# Altium project AMC_FMC_Carrier.PrjPcb (part 2 of 9)

## Sheet FPGA_SDRAM.SchDoc
size A3; DocumentNumber: 18; SheetNumber: 18; SheetTotal: 30
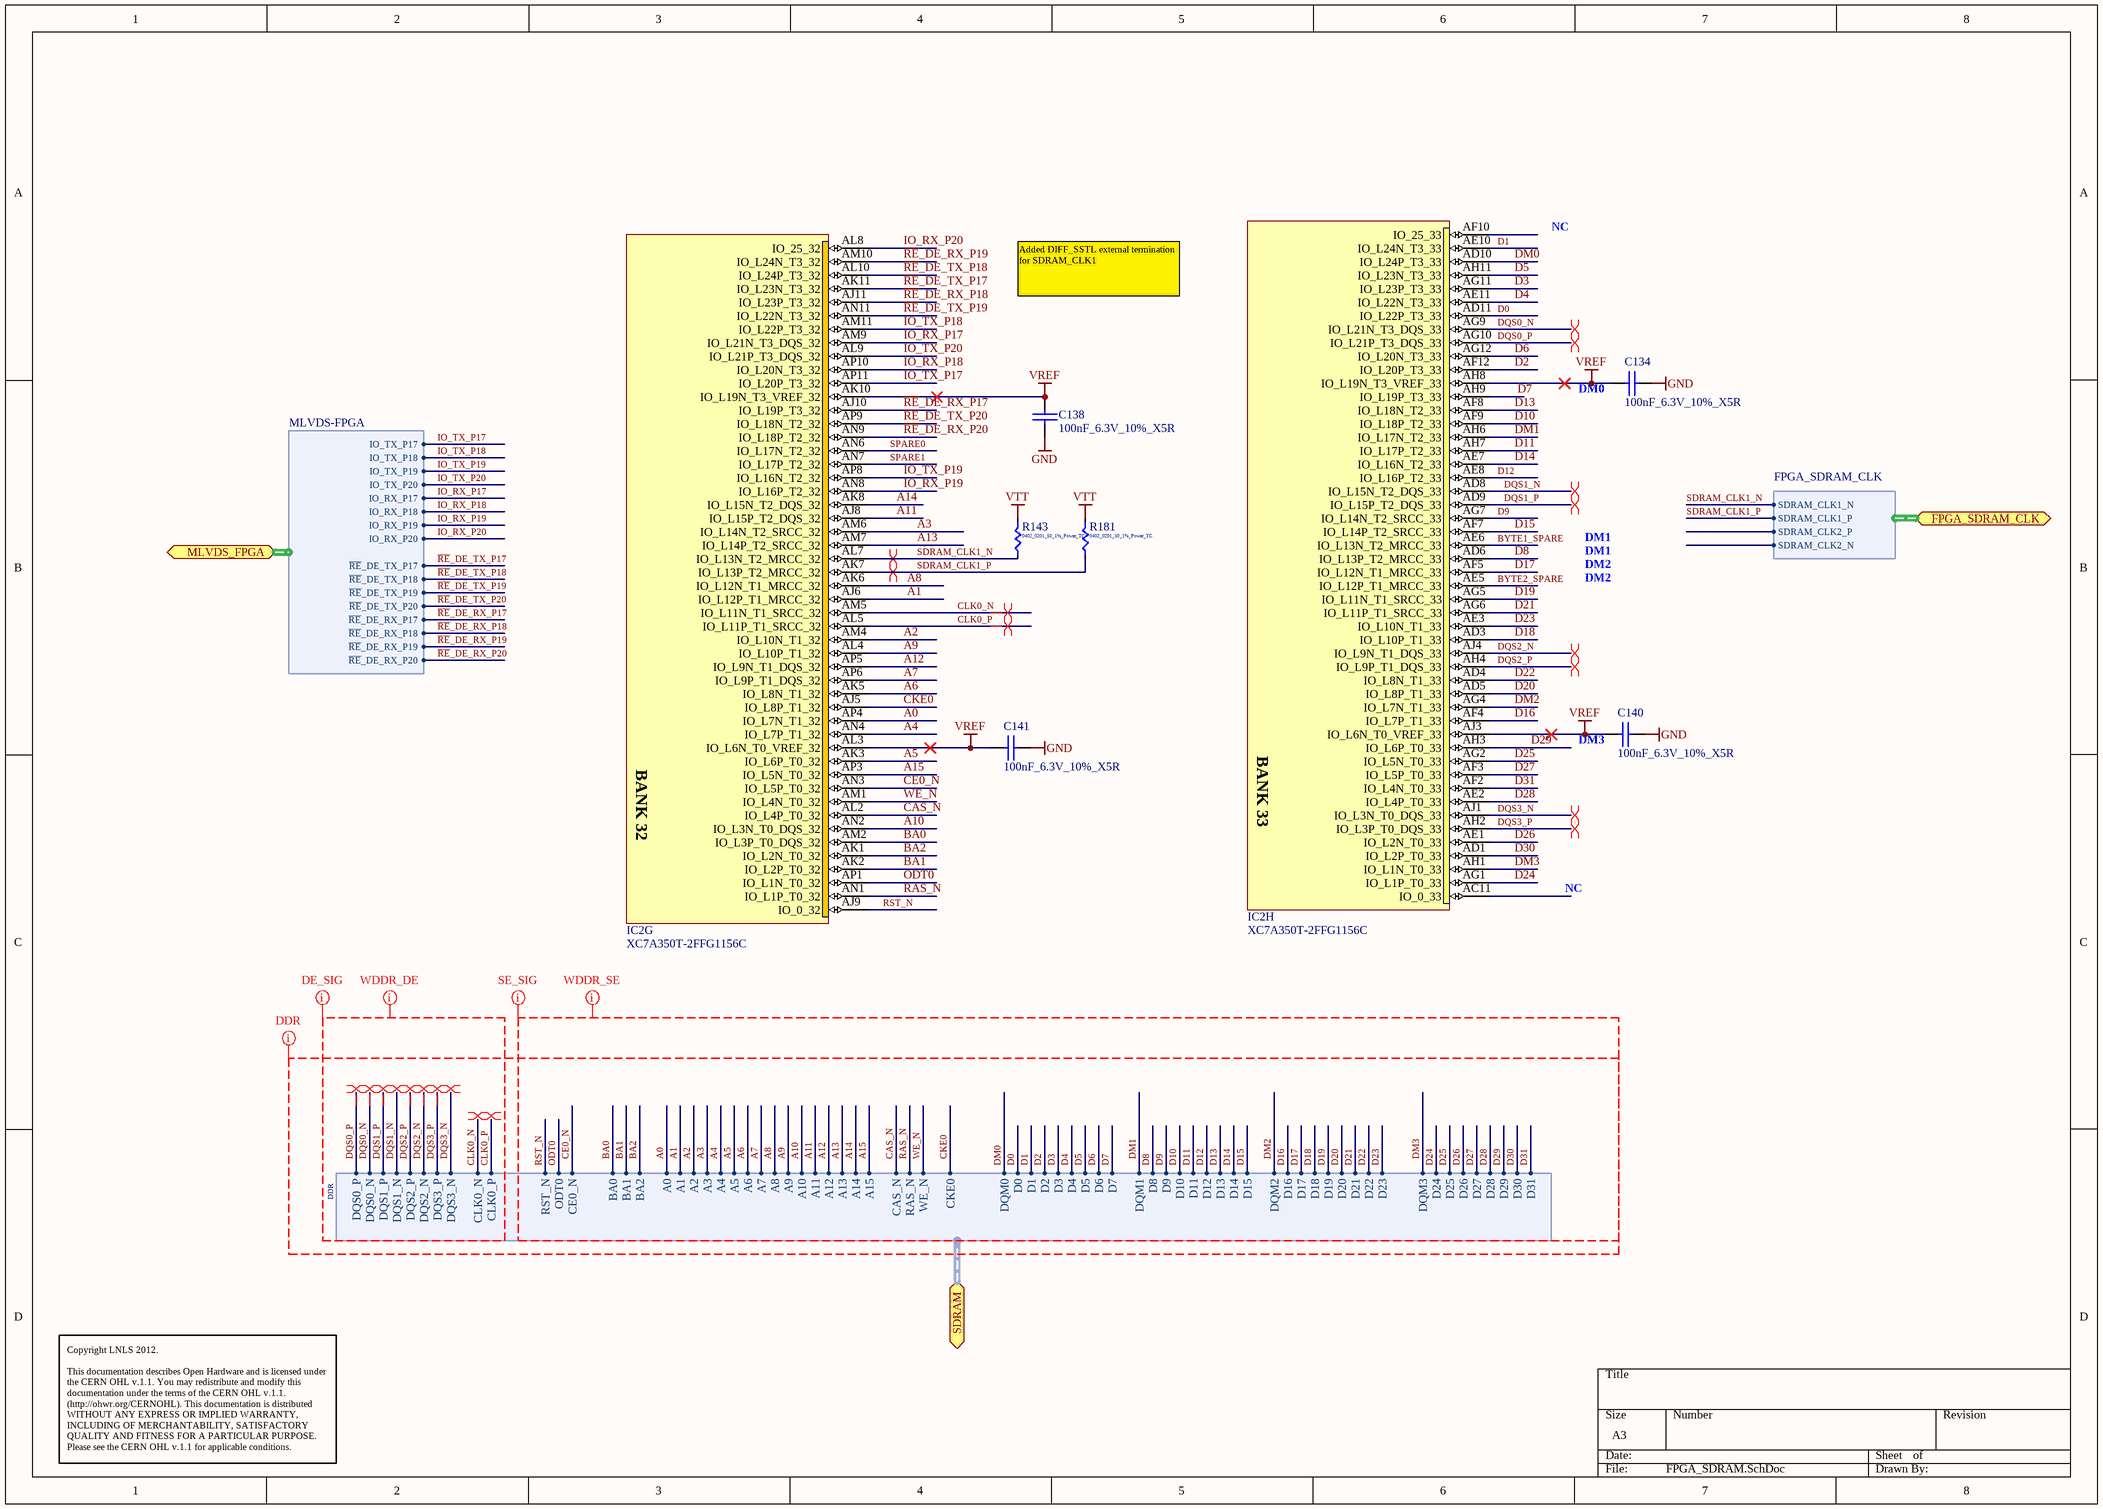
[diagram p4: FPGA_SDRAM.SchDoc]

### Parts
C134  100nF_6.3V_10%_X5R  [0201C]
C138  100nF_6.3V_10%_X5R  [0201C]
C140  100nF_6.3V_10%_X5R  [0201C]
C141  100nF_6.3V_10%_X5R  [0201C]
IC2  XC7A350T-2FFG1156C  [BGA1156C100P34X34_3500X3500X335]  (parts G,H of 23)
R143  0402_0201_50_1%_Power_TC  [RESC0603X40N]
R181  0402_0201_50_1%_Power_TC  [RESC0603X40N]

### Ports
FPGA_SDRAM_CLK (harness FPGA_SDRAM_CLK), MLVDS_FPGA (harness MLVDS-FPGA), SDRAM (harness DDR)

### Harnesses
DDR: CKE0, A0, A1, A2, A3, A4, A5, A7, A8, A9, A10, A11, A12, A13, BA0, BA1, BA2, A14, A15, CAS_N, RAS_N, WE_N, CE0_N, A6, D0, D1, D2, D3, D4, D5, D6, D7, D8, D9, D10, D11, D12, D13, D14, D15, CLK0_N, CLK0_P, ODT0, RST_N, D16, D17, D18, D19, D20, D21, D22, D23, D24, D25, D26, D27, D28, D29, D30, D31, DQS0_P, DQS1_P, DQS0_N, DQS1_N, DQS3_N, DQS3_P, DQS2_P, DQS2_N, DQM0, DQM1, DQM2, DQM3
MLVDS-FPGA: IO_TX_P17, IO_TX_P18, IO_TX_P19, IO_TX_P20, IO_RX_P17, IO_RX_P18, IO_RX_P19, IO_RX_P20, ~{RE}_DE_TX_P17, ~{RE}_DE_TX_P18, ~{RE}_DE_TX_P19, ~{RE}_DE_TX_P20, ~{RE}_DE_RX_P17, ~{RE}_DE_RX_P18, ~{RE}_DE_RX_P19, ~{RE}_DE_RX_P20
FPGA_SDRAM_CLK: SDRAM_CLK1_N, SDRAM_CLK1_P, SDRAM_CLK2_P, SDRAM_CLK2_N

### Nets
GND: C134.2 C138.2 C140.2 C141.2
VREF: C134.1 C138.1 C140.1 C141.1 IC2.AH8(IO_L19N_T3_VREF_33) IC2.AJ3(IO_L6N_T0_VREF_33) IC2.AK10(IO_L19N_T3_VREF_32) IC2.AL3(IO_L6N_T0_VREF_32)
VTT: R143.1(+) R181.1(+)
A0: IC2.AP4(IO_L7N_T1_32) ; port SDRAM.A0  [project net FDDR.A0]
A1: IC2.AJ6(IO_L12P_T1_MRCC_32) ; port SDRAM.A1  [project net FDDR.A1]
A2: IC2.AM4(IO_L10N_T1_32) ; port SDRAM.A2  [project net FDDR.A2]
A3: IC2.AM6(IO_L14N_T2_SRCC_32) ; port SDRAM.A3  [project net FDDR.A3]
A4: IC2.AN4(IO_L7P_T1_32) ; port SDRAM.A4  [project net FDDR.A4]
A5: IC2.AK3(IO_L6P_T0_32) ; port SDRAM.A5  [project net FDDR.A5]
A6: IC2.AK5(IO_L8N_T1_32) ; port SDRAM.A6  [project net FDDR.A6]
A7: IC2.AP6(IO_L9P_T1_DQS_32) ; port SDRAM.A7  [project net FDDR.A7]
A8: IC2.AK6(IO_L12N_T1_MRCC_32) ; port SDRAM.A8  [project net FDDR.A8]
A9: IC2.AL4(IO_L10P_T1_32) ; port SDRAM.A9  [project net FDDR.A9]
A10: IC2.AN2(IO_L3N_T0_DQS_32) ; port SDRAM.A10  [project net FDDR.A10]
A11: IC2.AJ8(IO_L15P_T2_DQS_32) ; port SDRAM.A11  [project net FDDR.A11]
A12: IC2.AP5(IO_L9N_T1_DQS_32) ; port SDRAM.A12  [project net FDDR.A12]
A13: IC2.AM7(IO_L14P_T2_SRCC_32) ; port SDRAM.A13  [project net FDDR.A13]
A14: IC2.AK8(IO_L15N_T2_DQS_32) ; port SDRAM.A14  [project net FDDR.A14]
A15: IC2.AP3(IO_L5N_T0_32) ; port SDRAM.A15  [project net FDDR.A15]
BA0: IC2.AM2(IO_L3P_T0_DQS_32) ; port SDRAM.BA0  [project net FDDR.BA0]
BA1: IC2.AK2(IO_L2P_T0_32) ; port SDRAM.BA1  [project net FDDR.BA1]
BA2: IC2.AK1(IO_L2N_T0_32) ; port SDRAM.BA2  [project net FDDR.BA2]
BYTE1_SPARE: IC2.AE6(IO_L13N_T2_MRCC_33)
BYTE2_SPARE: IC2.AE5(IO_L12P_T1_MRCC_33)
CAS_N: IC2.AL2(IO_L4P_T0_32) ; port SDRAM.CAS_N  [project net FDDR.CAS_N]
CE0_N: IC2.AN3(IO_L5P_T0_32) ; port SDRAM.CE0_N  [project net FDDR.CE0_N]
CKE0: IC2.AJ5(IO_L8P_T1_32) ; port SDRAM.CKE0  [project net FDDR.CKE0]
CLK0_N: IC2.AM5(IO_L11N_T1_SRCC_32) ; port SDRAM.CLK0_N  [project net FDDR.CLK0_N]
CLK0_P: IC2.AL5(IO_L11P_T1_SRCC_32) ; port SDRAM.CLK0_P  [project net FDDR.CLK0_P]
D0: IC2.AD11(IO_L22P_T3_33) ; port SDRAM.D0  [project net FDDR.D0]
D1: IC2.AE10(IO_L24N_T3_33) ; port SDRAM.D1  [project net FDDR.D1]
D2: IC2.AF12(IO_L20P_T3_33) ; port SDRAM.D2  [project net FDDR.D2]
D3: IC2.AG11(IO_L23P_T3_33) ; port SDRAM.D3  [project net FDDR.D3]
D4: IC2.AE11(IO_L22N_T3_33) ; port SDRAM.D4  [project net FDDR.D4]
D5: IC2.AH11(IO_L23N_T3_33) ; port SDRAM.D5  [project net FDDR.D5]
D6: IC2.AG12(IO_L20N_T3_33) ; port SDRAM.D6  [project net FDDR.D6]
D7: IC2.AH9(IO_L19P_T3_33) ; port SDRAM.D7  [project net FDDR.D7]
D8: IC2.AD6(IO_L13P_T2_MRCC_33) ; port SDRAM.D8  [project net FDDR.D8]
D9: IC2.AG7(IO_L14N_T2_SRCC_33) ; port SDRAM.D9  [project net FDDR.D9]
D10: IC2.AF9(IO_L18P_T2_33) ; port SDRAM.D10  [project net FDDR.D10]
D11: IC2.AH7(IO_L17P_T2_33) ; port SDRAM.D11  [project net FDDR.D11]
D12: IC2.AE8(IO_L16P_T2_33) ; port SDRAM.D12  [project net FDDR.D12]
D13: IC2.AF8(IO_L18N_T2_33) ; port SDRAM.D13  [project net FDDR.D13]
D14: IC2.AE7(IO_L16N_T2_33) ; port SDRAM.D14  [project net FDDR.D14]
D15: IC2.AF7(IO_L14P_T2_SRCC_33) ; port SDRAM.D15  [project net FDDR.D15]
D16: IC2.AF4(IO_L7P_T1_33) ; port SDRAM.D16  [project net FDDR.D16]
D17: IC2.AF5(IO_L12N_T1_MRCC_33) ; port SDRAM.D17  [project net FDDR.D17]
D18: IC2.AD3(IO_L10P_T1_33) ; port SDRAM.D18  [project net FDDR.D18]
D19: IC2.AG5(IO_L11N_T1_SRCC_33) ; port SDRAM.D19  [project net FDDR.D19]
D20: IC2.AD5(IO_L8P_T1_33) ; port SDRAM.D20  [project net FDDR.D20]
D21: IC2.AG6(IO_L11P_T1_SRCC_33) ; port SDRAM.D21  [project net FDDR.D21]
D22: IC2.AD4(IO_L8N_T1_33) ; port SDRAM.D22  [project net FDDR.D22]
D23: IC2.AE3(IO_L10N_T1_33) ; port SDRAM.D23  [project net FDDR.D23]
D24: IC2.AG1(IO_L1P_T0_33) ; port SDRAM.D24  [project net FDDR.D24]
D25: IC2.AG2(IO_L5N_T0_33) ; port SDRAM.D25  [project net FDDR.D25]
D26: IC2.AE1(IO_L2N_T0_33) ; port SDRAM.D26  [project net FDDR.D26]
D27: IC2.AF3(IO_L5P_T0_33) ; port SDRAM.D27  [project net FDDR.D27]
D28: IC2.AE2(IO_L4P_T0_33) ; port SDRAM.D28  [project net FDDR.D28]
D29: IC2.AH3(IO_L6P_T0_33) ; port SDRAM.D29  [project net FDDR.D29]
D30: IC2.AD1(IO_L2P_T0_33) ; port SDRAM.D30  [project net FDDR.D30]
D31: IC2.AF2(IO_L4N_T0_33) ; port SDRAM.D31  [project net FDDR.D31]
DM0: IC2.AD10(IO_L24P_T3_33) ; port SDRAM.DQM0  [project net FDDR.DQM0]
DM1: IC2.AH6(IO_L17N_T2_33) ; port SDRAM.DQM1  [project net FDDR.DQM1]
DM2: IC2.AG4(IO_L7N_T1_33) ; port SDRAM.DQM2  [project net FDDR.DQM2]
DM3: IC2.AH1(IO_L1N_T0_33) ; port SDRAM.DQM3  [project net FDDR.DQM3]
DQS0_N: IC2.AG9(IO_L21N_T3_DQS_33) ; port SDRAM.DQS0_N  [project net FDDR.DQS0_N]
DQS0_P: IC2.AG10(IO_L21P_T3_DQS_33) ; port SDRAM.DQS0_P  [project net FDDR.DQS0_P]
DQS1_N: IC2.AD8(IO_L15N_T2_DQS_33) ; port SDRAM.DQS1_N  [project net FDDR.DQS1_N]
DQS1_P: IC2.AD9(IO_L15P_T2_DQS_33) ; port SDRAM.DQS1_P  [project net FDDR.DQS1_P]
DQS2_N: IC2.AJ4(IO_L9N_T1_DQS_33) ; port SDRAM.DQS2_N  [project net FDDR.DQS2_N]
DQS2_P: IC2.AH4(IO_L9P_T1_DQS_33) ; port SDRAM.DQS2_P  [project net FDDR.DQS2_P]
DQS3_N: IC2.AJ1(IO_L3N_T0_DQS_33) ; port SDRAM.DQS3_N  [project net FDDR.DQS3_N]
DQS3_P: IC2.AH2(IO_L3P_T0_DQS_33) ; port SDRAM.DQS3_P  [project net FDDR.DQS3_P]
IO_RX_P17: IC2.AM9(IO_L21N_T3_DQS_32) ; port MLVDS_FPGA.IO_RX_P17  [project net MLVDS_F.IO_RX_P17]
IO_RX_P18: IC2.AP10(IO_L20N_T3_32) ; port MLVDS_FPGA.IO_RX_P18  [project net MLVDS_F.IO_RX_P18]
IO_RX_P19: IC2.AN8(IO_L16P_T2_32) ; port MLVDS_FPGA.IO_RX_P19  [project net MLVDS_F.IO_RX_P19]
IO_RX_P20: IC2.AL8(IO_25_32) ; port MLVDS_FPGA.IO_RX_P20  [project net MLVDS_F.IO_RX_P20]
IO_TX_P17: IC2.AP11(IO_L20P_T3_32) ; port MLVDS_FPGA.IO_TX_P17  [project net MLVDS_F.IO_TX_P17]
IO_TX_P18: IC2.AM11(IO_L22P_T3_32) ; port MLVDS_FPGA.IO_TX_P18  [project net MLVDS_F.IO_TX_P18]
IO_TX_P19: IC2.AP8(IO_L16N_T2_32) ; port MLVDS_FPGA.IO_TX_P19  [project net MLVDS_F.IO_TX_P19]
IO_TX_P20: IC2.AL9(IO_L21P_T3_DQS_32) ; port MLVDS_FPGA.IO_TX_P20  [project net MLVDS_F.IO_TX_P20]
ODT0: IC2.AP1(IO_L1N_T0_32) ; port SDRAM.ODT0  [project net FDDR.ODT0]
~{RE}_DE_RX_P17: IC2.AJ10(IO_L19P_T3_32) ; port MLVDS_FPGA.~{RE}_DE_RX_P17  [project net MLVDS_F.~{RE}_DE_RX_P17]
~{RE}_DE_RX_P18: IC2.AJ11(IO_L23P_T3_32) ; port MLVDS_FPGA.~{RE}_DE_RX_P18  [project net MLVDS_F.~{RE}_DE_RX_P18]
~{RE}_DE_RX_P19: IC2.AM10(IO_L24N_T3_32) ; port MLVDS_FPGA.~{RE}_DE_RX_P19  [project net MLVDS_F.~{RE}_DE_RX_P19]
~{RE}_DE_RX_P20: IC2.AN9(IO_L18P_T2_32) ; port MLVDS_FPGA.~{RE}_DE_RX_P20  [project net MLVDS_F.~{RE}_DE_RX_P20]
~{RE}_DE_TX_P17: IC2.AK11(IO_L23N_T3_32) ; port MLVDS_FPGA.~{RE}_DE_TX_P17  [project net MLVDS_F.~{RE}_DE_TX_P17]
~{RE}_DE_TX_P18: IC2.AL10(IO_L24P_T3_32) ; port MLVDS_FPGA.~{RE}_DE_TX_P18  [project net MLVDS_F.~{RE}_DE_TX_P18]
~{RE}_DE_TX_P19: IC2.AN11(IO_L22N_T3_32) ; port MLVDS_FPGA.~{RE}_DE_TX_P19  [project net MLVDS_F.~{RE}_DE_TX_P19]
~{RE}_DE_TX_P20: IC2.AP9(IO_L18N_T2_32) ; port MLVDS_FPGA.~{RE}_DE_TX_P20  [project net MLVDS_F.~{RE}_DE_TX_P20]
RAS_N: IC2.AN1(IO_L1P_T0_32) ; port SDRAM.RAS_N  [project net FDDR.RAS_N]
RST_N: IC2.AJ9(IO_0_32) ; port SDRAM.RST_N  [project net FDDR.RST_N]
SDRAM_CLK1_N: IC2.AL7(IO_L13N_T2_MRCC_32) R143.2(-) ; port FPGA_SDRAM_CLK.SDRAM_CLK1_N  [project net FSDC.SDRAM_CLK1_N]
SDRAM_CLK1_P: IC2.AK7(IO_L13P_T2_MRCC_32) R181.2(-) ; port FPGA_SDRAM_CLK.SDRAM_CLK1_P  [project net FSDC.SDRAM_CLK1_P]
SPARE0: IC2.AN6(IO_L17N_T2_32)
SPARE1: IC2.AN7(IO_L17P_T2_32)
WE_N: IC2.AM1(IO_L4N_T0_32) ; port SDRAM.WE_N  [project net FDDR.WE_N]

Not connected (* = marked no-connect by the designer): IC2 AC11(IO_0_33) AF10(IO_25_33)

### Layout directives
differential pair: FDDR.CLK0_N, FDDR.CLK0_P, FDDR.DQS0_N, FDDR.DQS0_P, FDDR.DQS1_N, FDDR.DQS1_P, FDDR.DQS2_N, FDDR.DQS2_P, FDDR.DQS3_N, FDDR.DQS3_P, FSDC.SDRAM_CLK1_N, FSDC.SDRAM_CLK1_P
net class DDR: A0, A1, A2, A3, A4, A5, A6, A7, A8, A9, A10, A11, A12, A13, A14, A15, BA0, BA1, BA2, CAS_N, CE0_N, CKE0, CLK0_N, CLK0_P, D0, D1, D2, D3, D4, D5, D6, D7, D8, D9, D10, D11, D12, D13, D14, D15, D16, D17, D18, D19, D20, D21, D22, D23, D24, D25, D26, D27, D28, D29, D30, D31, DM0, DM1, DM2, DM3, DQS0_N, DQS0_P, DQS1_N, DQS1_P, DQS2_N, DQS2_P, DQS3_N, DQS3_P, ODT0, RAS_N, RST_N, WE_N
net class DE_SIG: CLK0_N, CLK0_P, DQS0_N, DQS0_P, DQS1_N, DQS1_P, DQS2_N, DQS2_P, DQS3_N, DQS3_P
net class SE_SIG: A0, A1, A2, A3, A4, A5, A6, A7, A8, A9, A10, A11, A12, A13, A14, A15, BA0, BA1, BA2, CAS_N, CE0_N, CKE0, D0, D1, D2, D3, D4, D5, D6, D7, D8, D9, D10, D11, D12, D13, D14, D15, D16, D17, D18, D19, D20, D21, D22, D23, D24, D25, D26, D27, D28, D29, D30, D31, DM0, DM1, DM2, DM3, ODT0, RAS_N, RST_N, WE_N
net class WDDR_DE: CLK0_N, CLK0_P, DQS0_N, DQS0_P, DQS1_N, DQS1_P, DQS2_N, DQS2_P, DQS3_N, DQS3_P
net class WDDR_SE: A0, A1, A2, A3, A4, A5, A6, A7, A8, A9, A10, A11, A12, A13, A14, A15, BA0, BA1, BA2, CAS_N, CE0_N, CKE0, D0, D1, D2, D3, D4, D5, D6, D7, D8, D9, D10, D11, D12, D13, D14, D15, D16, D17, D18, D19, D20, D21, D22, D23, D24, D25, D26, D27, D28, D29, D30, D31, DM0, DM1, DM2, DM3, ODT0, RAS_N, RST_N, WE_N

### Notes on the sheet
- NC
- Added DIFF_SSTL external termination for SDRAM_CLK1
- (near C134) DM0
- DM1
- DM2
- (near C140) DM3
- Copyright LNLS 2012.
  This documentation describes Open Hardware and is licensed under the CERN OHL v.1.1. You may redistribute and modify this documentation under the terms of the CERN OHL v.1.1. (http://ohwr.org/CERNOHL). This documentation is distributed WITHOUT ANY EXPRESS OR IMPLIED WARRANTY, INCLUDING OF MERCHANTABILITY, SATISFACTORY QUALITY AND FITNESS FOR A PARTICULAR PURPOSE. Please see the CERN OHL v.1.1 for applicable conditions.
- (in symbol XC7A350T-2FFG1156C, part G) BANK 32
- (in symbol XC7A350T-2FFG1156C, part H) BANK 33

### Library data of the parts
C134 C138 C140 C141 = CAP_SMD_0201: Capacitor SMD
IC2 = XC7A350T-2FFG1156C: as IC2 on sheet FPGA; Part Number: XC7A350T-2FFG1156C; Component Kind: Standard; Component Type: Standard; Device: XC7A350T-2FFG1156C; PackageDescription: BGA, 1.00mm Pitch, Square; 1156 Pin, 34 Columns X 34 Rows, 35.00mm X 35.00mm X 3.350mm H; Manufacturer Part Number: XC7A350T-2FFG1156C; Pin Count: 1156; Case: BGA1156; Mounted: Yes; Socket: No; SMD: Yes; ComponentHeight: 3.35mm; HelpURL: \\cern.ch\dfs\Applications\Altium\Datasheets\XC7A350T-2FFG1156C.pdf; ComponentLink1URL: \\cern.ch\dfs\Applications\Altium\Datasheets\XC7A350T-2FFG1156C.pdf; ComponentLink1Description: Package/Pinout; Author: CERN DEM JLC; CreateDate: 2012-09-19; LatestRevisionDate: 2012-09-19
R143 R181 = SMT_0402_0201: MiscInfo: Biggest Cern Footprint [max height]; Document Name: FPGA_SDRAM.SchDoc; Part Number: SMT_0402_0201; FootprintSizeX (mm): 1.8; FootprintSizeY (mm): 0.9; FootprintRectangleArea (mm): 1.62; Thickness (Max) (mm): 0.4; FootprintAlias: 0402

## Sheet FMC_HPC1.SchDoc
size A3; DocumentNumber: 19; SheetNumber: 19; SheetTotal: 30
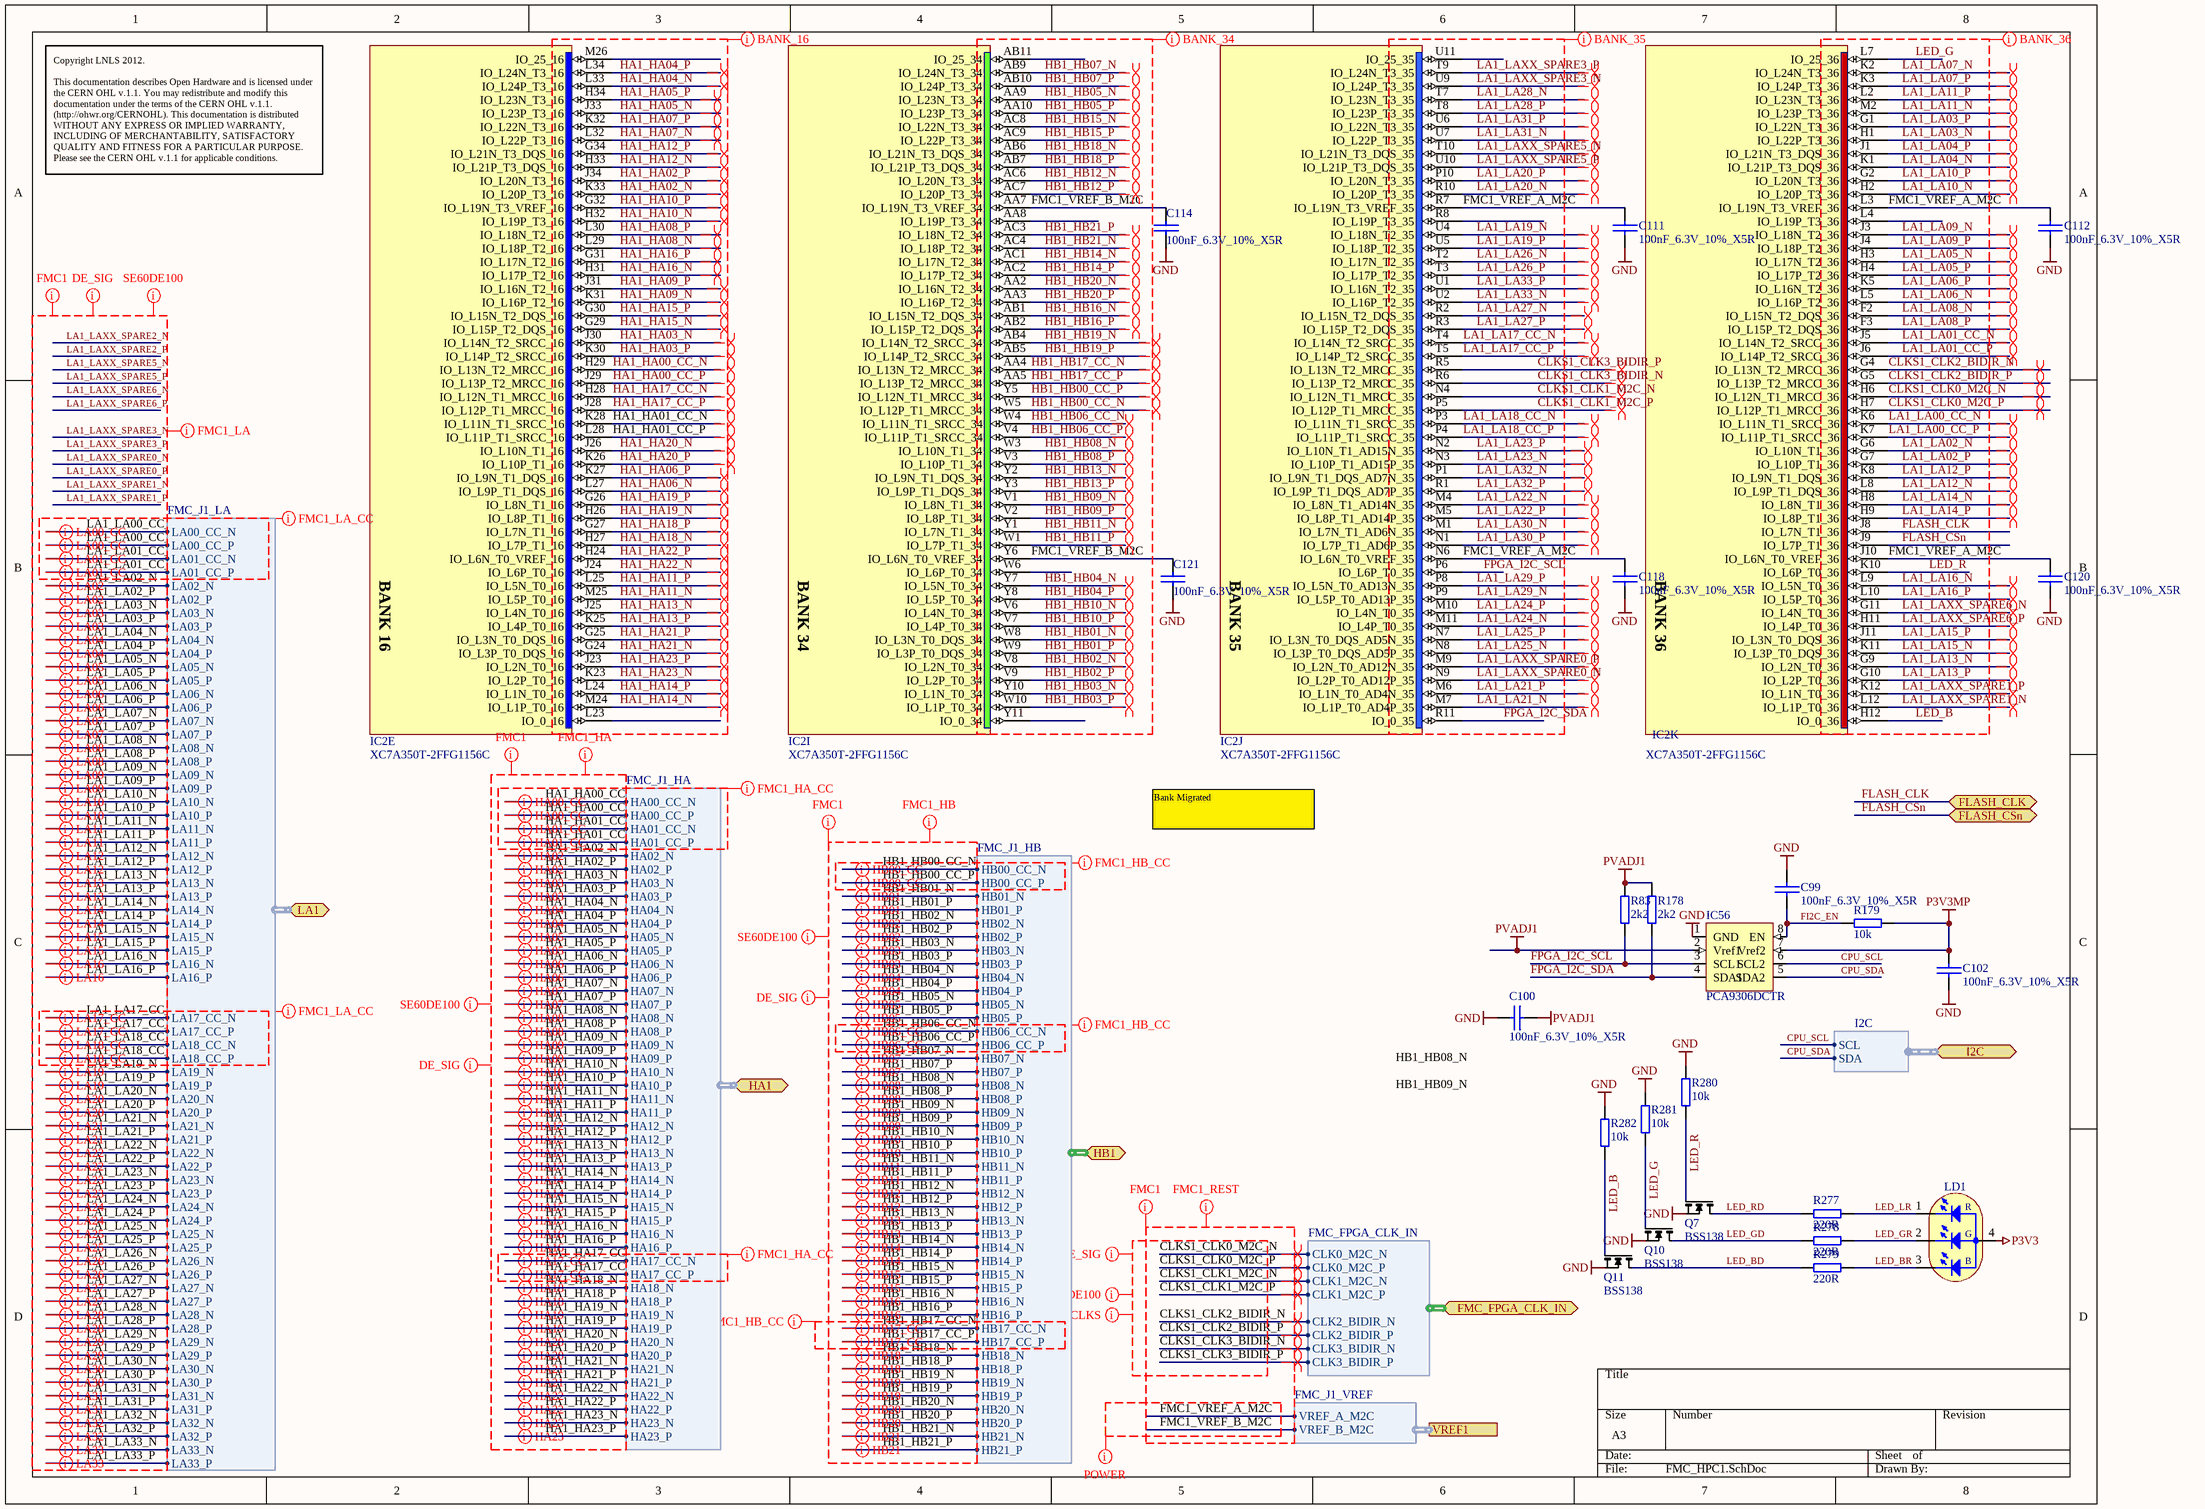
[diagram p5: FMC_HPC1.SchDoc]

### Parts
C99  100nF_6.3V_10%_X5R  [0201C]
C100  100nF_6.3V_10%_X5R  [0201C]
C102  100nF_6.3V_10%_X5R  [0201C]
C111  100nF_6.3V_10%_X5R  [0201C]
C112  100nF_6.3V_10%_X5R  [0201C]
C114  100nF_6.3V_10%_X5R  [0201C]
C118  100nF_6.3V_10%_X5R  [0201C]
C120  100nF_6.3V_10%_X5R  [0201C]
C121  100nF_6.3V_10%_X5R  [0201C]
IC2  XC7A350T-2FFG1156C  [BGA1156C100P34X34_3500X3500X335]  (parts E,I,J,K of 23)
IC56  PCA9306DCTR  [SSOP8]
LD1  Red/Green/Blue  [LED_OPTEK_OVSRRGBCC3_a]  (value not drawn)
Q7  BSS138  [SOT-23]
Q10  BSS138  [SOT-23]
Q11  BSS138  [SOT-23]
R83  2k2  [0402R]
R178  2k2  [0402R]
R179  10k  [0402R]
R277  220R  [0402R]
R278  220R  [0402R]
R279  220R  [0402R]
R280  10k  [0402R]
R281  10k  [0402R]
R282  10k  [0402R]

### Ports
FLASH_CLK, FLASH_CSn, FMC_FPGA_CLK_IN (harness FMC_FPGA_CLK_IN), HA1 (harness FMC_J1_HA), HB1 (harness FMC_J1_HB), I2C (harness I2C), LA1 (harness FMC_J1_LA), VREF1 (harness FMC_J1_VREF)

### Harnesses
FMC_J1_LA: LA05_N, LA05_P, LA06_N, LA06_P, LA09_N, LA09_P, LA10_N, LA10_P, LA13_N, LA13_P, LA14_N, LA14_P, LA23_N, LA23_P, LA26_N, LA26_P, LA27_N, LA27_P, LA02_N, LA02_P, LA03_N, LA03_P, LA04_N, LA04_P, LA07_N, LA07_P, LA08_N, LA08_P, LA11_N, LA11_P, LA12_N, LA12_P, LA15_N, LA15_P, LA16_N, LA16_P, LA19_N, LA19_P, LA20_N, LA20_P, LA21_N, LA21_P, LA22_N, LA22_P, LA24_N, LA24_P, LA25_N, LA25_P, LA28_N, LA28_P, LA29_N, LA29_P, LA30_N, LA30_P, LA31_N, LA31_P, LA32_N, LA32_P, LA33_N, LA33_P, LA00_CC_N, LA00_CC_P, LA01_CC_N, LA01_CC_P, LA17_CC_N, LA17_CC_P, LA18_CC_N, LA18_CC_P
FMC_J1_VREF: VREF_A_M2C, VREF_B_M2C
FMC_FPGA_CLK_IN: CLK0_M2C_N, CLK0_M2C_P, CLK1_M2C_N, CLK1_M2C_P, CLK2_BIDIR_N, CLK2_BIDIR_P, CLK3_BIDIR_N, CLK3_BIDIR_P
FMC_J1_HB: HB02_N, HB02_P, HB03_N, HB03_P, HB04_N, HB04_P, HB05_N, HB05_P, HB08_N, HB08_P, HB09_N, HB09_P, HB12_N, HB12_P, HB13_N, HB13_P, HB16_N, HB16_P, HB19_N, HB19_P, HB20_N, HB20_P, HB21_N, HB21_P, HB01_N, HB01_P, HB07_N, HB07_P, HB10_N, HB10_P, HB11_N, HB11_P, HB14_N, HB14_P, HB15_N, HB15_P, HB18_N, HB18_P, HB17_CC_N, HB17_CC_P, HB06_CC_N, HB06_CC_P, HB00_CC_N, HB00_CC_P
FMC_J1_HA: HA04_N, HA04_P, HA05_N, HA05_P, HA08_N, HA08_P, HA09_N, HA09_P, HA12_N, HA12_P, HA13_N, HA13_P, HA15_N, HA15_P, HA16_N, HA16_P, HA19_N, HA19_P, HA20_N, HA20_P, HA02_N, HA02_P, HA03_N, HA03_P, HA06_N, HA06_P, HA07_N, HA07_P, HA10_N, HA10_P, HA11_N, HA11_P, HA14_N, HA14_P, HA18_N, HA18_P, HA21_N, HA21_P, HA22_N, HA22_P, HA23_N, HA23_P, HA17_CC_N, HA17_CC_P, HA00_CC_N, HA00_CC_P, HA01_CC_N, HA01_CC_P
I2C: SCL, SDA

### Nets
GND: C99.2 C100.2 C102.2 C111.2 C112.2 C114.2 C118.2 C120.2 C121.2 IC56.1(GND) Q7.2(S) Q10.2(S) Q11.2(S) R280.1 R281.1 R282.1
P3V3: LD1.4(CC)
P3V3MP: C102.1 IC56.7(Vref2) R179.2
PVADJ1: C100.1 IC56.2(Vref1) R83.2 R178.2
CLKS1_CLK0_M2C_N: IC2.H6(IO_L12N_T1_MRCC_36) ; port FMC_FPGA_CLK_IN.CLK0_M2C_N  [project net CLKS1.CLK0_M2C_N]
CLKS1_CLK0_M2C_P: IC2.H7(IO_L12P_T1_MRCC_36) ; port FMC_FPGA_CLK_IN.CLK0_M2C_P  [project net CLKS1.CLK0_M2C_P]
CLKS1_CLK1_M2C_N: IC2.N4(IO_L12N_T1_MRCC_35) ; port FMC_FPGA_CLK_IN.CLK1_M2C_N  [project net CLKS1.CLK1_M2C_N]
CLKS1_CLK1_M2C_P: IC2.P5(IO_L12P_T1_MRCC_35) ; port FMC_FPGA_CLK_IN.CLK1_M2C_P  [project net CLKS1.CLK1_M2C_P]
CLKS1_CLK2_BIDIR_N: IC2.G4(IO_L13N_T2_MRCC_36) ; port FMC_FPGA_CLK_IN.CLK2_BIDIR_N  [project net CLKS1.CLK2_BIDIR_N]
CLKS1_CLK2_BIDIR_P: IC2.G5(IO_L13P_T2_MRCC_36) ; port FMC_FPGA_CLK_IN.CLK2_BIDIR_P  [project net CLKS1.CLK2_BIDIR_P]
CLKS1_CLK3_BIDIR_N: IC2.R6(IO_L13P_T2_MRCC_35) ; port FMC_FPGA_CLK_IN.CLK3_BIDIR_N  [project net CLKS1.CLK3_BIDIR_N]
CLKS1_CLK3_BIDIR_P: IC2.R5(IO_L13N_T2_MRCC_35) ; port FMC_FPGA_CLK_IN.CLK3_BIDIR_P  [project net CLKS1.CLK3_BIDIR_P]
CPU_SCL: IC56.6(SCL2) ; port I2C.SCL  [project net CPU.SCL]
CPU_SDA: IC56.5(SDA2) ; port I2C.SDA  [project net CPU.SDA]
FI2C_EN: C99.1 IC56.8(EN) R179.1
FLASH_CLK: IC2.J8(IO_L7N_T1_36) ; port FLASH_CLK
FLASH_CSn: IC2.J9(IO_L7P_T1_36) ; port FLASH_CSn
FMC1_VREF_A_M2C: C111.1 C112.1 C118.1 C120.1 IC2.J10(IO_L6N_T0_VREF_36) IC2.L3(IO_L19N_T3_VREF_36) IC2.N6(IO_L6N_T0_VREF_35) IC2.R7(IO_L19N_T3_VREF_35) ; port VREF1.VREF_A_M2C  [project net VREF1.VREF_A_M2C]
FMC1_VREF_B_M2C: C114.1 C121.1 IC2.AA7(IO_L19N_T3_VREF_34) IC2.Y6(IO_L6N_T0_VREF_34) ; port VREF1.VREF_B_M2C  [project net VREF1.VREF_B_M2C]
FPGA_I2C_SCL: IC2.P6(IO_L6P_T0_35) IC56.3(SCL1) R83.1
FPGA_I2C_SDA: IC2.R11(IO_0_35) IC56.4(SDA1) R178.1
HA1_HA00_CC_N: IC2.H29(IO_L13N_T2_MRCC_16) ; port HA1.HA00_CC_N  [project net HA1.HA00_CC_N]
HA1_HA00_CC_P: IC2.J29(IO_L13P_T2_MRCC_16) ; port HA1.HA00_CC_P  [project net HA1.HA00_CC_P]
HA1_HA01_CC_N: IC2.K28(IO_L11N_T1_SRCC_16) ; port HA1.HA01_CC_N  [project net HA1.HA01_CC_N]
HA1_HA01_CC_P: IC2.L28(IO_L11P_T1_SRCC_16) ; port HA1.HA01_CC_P  [project net HA1.HA01_CC_P]
HA1_HA02_N: IC2.K33(IO_L20P_T3_16) ; port HA1.HA02_N  [project net HA1.HA02_N]
HA1_HA02_P: IC2.J34(IO_L20N_T3_16) ; port HA1.HA02_P  [project net HA1.HA02_P]
HA1_HA03_N: IC2.J30(IO_L14N_T2_SRCC_16) ; port HA1.HA03_N  [project net HA1.HA03_N]
HA1_HA03_P: IC2.K30(IO_L14P_T2_SRCC_16) ; port HA1.HA03_P  [project net HA1.HA03_P]
HA1_HA04_N: IC2.L33(IO_L24P_T3_16) ; port HA1.HA04_N  [project net HA1.HA04_N]
HA1_HA04_P: IC2.L34(IO_L24N_T3_16) ; port HA1.HA04_P  [project net HA1.HA04_P]
HA1_HA05_N: IC2.J33(IO_L23P_T3_16) ; port HA1.HA05_N  [project net HA1.HA05_N]
HA1_HA05_P: IC2.H34(IO_L23N_T3_16) ; port HA1.HA05_P  [project net HA1.HA05_P]
HA1_HA06_N: IC2.L27(IO_L9P_T1_DQS_16) ; port HA1.HA06_N  [project net HA1.HA06_N]
HA1_HA06_P: IC2.K27(IO_L9N_T1_DQS_16) ; port HA1.HA06_P  [project net HA1.HA06_P]
HA1_HA07_N: IC2.L32(IO_L22P_T3_16) ; port HA1.HA07_N  [project net HA1.HA07_N]
HA1_HA07_P: IC2.K32(IO_L22N_T3_16) ; port HA1.HA07_P  [project net HA1.HA07_P]
HA1_HA08_N: IC2.L29(IO_L18P_T2_16) ; port HA1.HA08_N  [project net HA1.HA08_N]
HA1_HA08_P: IC2.L30(IO_L18N_T2_16) ; port HA1.HA08_P  [project net HA1.HA08_P]
HA1_HA09_N: IC2.K31(IO_L16P_T2_16) ; port HA1.HA09_N  [project net HA1.HA09_N]
HA1_HA09_P: IC2.J31(IO_L16N_T2_16) ; port HA1.HA09_P  [project net HA1.HA09_P]
HA1_HA10_N: IC2.H32(IO_L19P_T3_16) ; port HA1.HA10_N  [project net HA1.HA10_N]
HA1_HA10_P: IC2.G32(IO_L19N_T3_VREF_16) ; port HA1.HA10_P  [project net HA1.HA10_P]
HA1_HA11_N: IC2.M25(IO_L5P_T0_16) ; port HA1.HA11_N  [project net HA1.HA11_N]
HA1_HA11_P: IC2.L25(IO_L5N_T0_16) ; port HA1.HA11_P  [project net HA1.HA11_P]
HA1_HA12_N: IC2.H33(IO_L21P_T3_DQS_16) ; port HA1.HA12_N  [project net HA1.HA12_N]
HA1_HA12_P: IC2.G34(IO_L21N_T3_DQS_16) ; port HA1.HA12_P  [project net HA1.HA12_P]
HA1_HA13_N: IC2.J25(IO_L4N_T0_16) ; port HA1.HA13_N  [project net HA1.HA13_N]
HA1_HA13_P: IC2.K25(IO_L4P_T0_16) ; port HA1.HA13_P  [project net HA1.HA13_P]
HA1_HA14_N: IC2.M24(IO_L1P_T0_16) ; port HA1.HA14_N  [project net HA1.HA14_N]
HA1_HA14_P: IC2.L24(IO_L1N_T0_16) ; port HA1.HA14_P  [project net HA1.HA14_P]
HA1_HA15_N: IC2.G29(IO_L15P_T2_DQS_16) ; port HA1.HA15_N  [project net HA1.HA15_N]
HA1_HA15_P: IC2.G30(IO_L15N_T2_DQS_16) ; port HA1.HA15_P  [project net HA1.HA15_P]
HA1_HA16_N: IC2.H31(IO_L17P_T2_16) ; port HA1.HA16_N  [project net HA1.HA16_N]
HA1_HA16_P: IC2.G31(IO_L17N_T2_16) ; port HA1.HA16_P  [project net HA1.HA16_P]
HA1_HA17_CC_N: IC2.H28(IO_L12N_T1_MRCC_16) ; port HA1.HA17_CC_N  [project net HA1.HA17_CC_N]
HA1_HA17_CC_P: IC2.J28(IO_L12P_T1_MRCC_16) ; port HA1.HA17_CC_P  [project net HA1.HA17_CC_P]
HA1_HA18_N: IC2.H27(IO_L7P_T1_16) ; port HA1.HA18_N  [project net HA1.HA18_N]
HA1_HA18_P: IC2.G27(IO_L7N_T1_16) ; port HA1.HA18_P  [project net HA1.HA18_P]
HA1_HA19_N: IC2.H26(IO_L8P_T1_16) ; port HA1.HA19_N  [project net HA1.HA19_N]
HA1_HA19_P: IC2.G26(IO_L8N_T1_16) ; port HA1.HA19_P  [project net HA1.HA19_P]
HA1_HA20_N: IC2.J26(IO_L10N_T1_16) ; port HA1.HA20_N  [project net HA1.HA20_N]
HA1_HA20_P: IC2.K26(IO_L10P_T1_16) ; port HA1.HA20_P  [project net HA1.HA20_P]
HA1_HA21_N: IC2.G24(IO_L3P_T0_DQS_16) ; port HA1.HA21_N  [project net HA1.HA21_N]
HA1_HA21_P: IC2.G25(IO_L3N_T0_DQS_16) ; port HA1.HA21_P  [project net HA1.HA21_P]
HA1_HA22_N: IC2.J24(IO_L6P_T0_16) ; port HA1.HA22_N  [project net HA1.HA22_N]
HA1_HA22_P: IC2.H24(IO_L6N_T0_VREF_16) ; port HA1.HA22_P  [project net HA1.HA22_P]
HA1_HA23_N: IC2.K23(IO_L2P_T0_16) ; port HA1.HA23_N  [project net HA1.HA23_N]
HA1_HA23_P: IC2.J23(IO_L2N_T0_16) ; port HA1.HA23_P  [project net HA1.HA23_P]
HB1_HB00_CC_N: IC2.W5(IO_L12P_T1_MRCC_34) ; port HB1.HB00_CC_N  [project net HB1.HB00_CC_N]
HB1_HB00_CC_P: IC2.Y5(IO_L12N_T1_MRCC_34) ; port HB1.HB00_CC_P  [project net HB1.HB00_CC_P]
HB1_HB01_N: IC2.W8(IO_L3N_T0_DQS_34) ; port HB1.HB01_N  [project net HB1.HB01_N]
HB1_HB01_P: IC2.W9(IO_L3P_T0_DQS_34) ; port HB1.HB01_P  [project net HB1.HB01_P]
HB1_HB02_N: IC2.V8(IO_L2N_T0_34) ; port HB1.HB02_N  [project net HB1.HB02_N]
HB1_HB02_P: IC2.V9(IO_L2P_T0_34) ; port HB1.HB02_P  [project net HB1.HB02_P]
HB1_HB03_N: IC2.Y10(IO_L1N_T0_34) ; port HB1.HB03_N  [project net HB1.HB03_N]
HB1_HB03_P: IC2.W10(IO_L1P_T0_34) ; port HB1.HB03_P  [project net HB1.HB03_P]
HB1_HB04_N: IC2.Y7(IO_L5N_T0_34) ; port HB1.HB04_N  [project net HB1.HB04_N]
HB1_HB04_P: IC2.Y8(IO_L5P_T0_34) ; port HB1.HB04_P  [project net HB1.HB04_P]
HB1_HB05_N: IC2.AA9(IO_L23N_T3_34) ; port HB1.HB05_N  [project net HB1.HB05_N]
HB1_HB05_P: IC2.AA10(IO_L23P_T3_34) ; port HB1.HB05_P  [project net HB1.HB05_P]
HB1_HB06_CC_N: IC2.W4(IO_L11N_T1_SRCC_34) ; port HB1.HB06_CC_N  [project net HB1.HB06_CC_N]
HB1_HB06_CC_P: IC2.V4(IO_L11P_T1_SRCC_34) ; port HB1.HB06_CC_P  [project net HB1.HB06_CC_P]
HB1_HB07_N: IC2.AB9(IO_L24N_T3_34) ; port HB1.HB07_N  [project net HB1.HB07_N]
HB1_HB07_P: IC2.AB10(IO_L24P_T3_34) ; port HB1.HB07_P  [project net HB1.HB07_P]
HB1_HB08_N: IC2.W3(IO_L10N_T1_34) ; port HB1.HB08_N  [project net HB1.HB08_N]
HB1_HB08_P: IC2.V3(IO_L10P_T1_34) ; port HB1.HB08_P  [project net HB1.HB08_P]
HB1_HB09_N: IC2.V1(IO_L8N_T1_34) ; port HB1.HB09_N  [project net HB1.HB09_N]
HB1_HB09_P: IC2.V2(IO_L8P_T1_34) ; port HB1.HB09_P  [project net HB1.HB09_P]
HB1_HB10_N: IC2.V6(IO_L4N_T0_34) ; port HB1.HB10_N  [project net HB1.HB10_N]
HB1_HB10_P: IC2.V7(IO_L4P_T0_34) ; port HB1.HB10_P  [project net HB1.HB10_P]
HB1_HB11_N: IC2.Y1(IO_L7N_T1_34) ; port HB1.HB11_N  [project net HB1.HB11_N]
HB1_HB11_P: IC2.W1(IO_L7P_T1_34) ; port HB1.HB11_P  [project net HB1.HB11_P]
HB1_HB12_N: IC2.AC6(IO_L20N_T3_34) ; port HB1.HB12_N  [project net HB1.HB12_N]
HB1_HB12_P: IC2.AC7(IO_L20P_T3_34) ; port HB1.HB12_P  [project net HB1.HB12_P]
HB1_HB13_N: IC2.Y2(IO_L9N_T1_DQS_34) ; port HB1.HB13_N  [project net HB1.HB13_N]
HB1_HB13_P: IC2.Y3(IO_L9P_T1_DQS_34) ; port HB1.HB13_P  [project net HB1.HB13_P]
HB1_HB14_N: IC2.AC1(IO_L17N_T2_34) ; port HB1.HB14_N  [project net HB1.HB14_N]
HB1_HB14_P: IC2.AC2(IO_L17P_T2_34) ; port HB1.HB14_P  [project net HB1.HB14_P]
HB1_HB15_N: IC2.AC8(IO_L22N_T3_34) ; port HB1.HB15_N  [project net HB1.HB15_N]
HB1_HB15_P: IC2.AC9(IO_L22P_T3_34) ; port HB1.HB15_P  [project net HB1.HB15_P]
HB1_HB16_N: IC2.AB1(IO_L15N_T2_DQS_34) ; port HB1.HB16_N  [project net HB1.HB16_N]
HB1_HB16_P: IC2.AB2(IO_L15P_T2_DQS_34) ; port HB1.HB16_P  [project net HB1.HB16_P]
HB1_HB17_CC_N: IC2.AA4(IO_L13N_T2_MRCC_34) ; port HB1.HB17_CC_N  [project net HB1.HB17_CC_N]
HB1_HB17_CC_P: IC2.AA5(IO_L13P_T2_MRCC_34) ; port HB1.HB17_CC_P  [project net HB1.HB17_CC_P]
HB1_HB18_N: IC2.AB6(IO_L21N_T3_DQS_34) ; port HB1.HB18_N  [project net HB1.HB18_N]
HB1_HB18_P: IC2.AB7(IO_L21P_T3_DQS_34) ; port HB1.HB18_P  [project net HB1.HB18_P]
HB1_HB19_N: IC2.AB4(IO_L14N_T2_SRCC_34) ; port HB1.HB19_N  [project net HB1.HB19_N]
HB1_HB19_P: IC2.AB5(IO_L14P_T2_SRCC_34) ; port HB1.HB19_P  [project net HB1.HB19_P]
HB1_HB20_N: IC2.AA2(IO_L16N_T2_34) ; port HB1.HB20_N  [project net HB1.HB20_N]
HB1_HB20_P: IC2.AA3(IO_L16P_T2_34) ; port HB1.HB20_P  [project net HB1.HB20_P]
HB1_HB21_N: IC2.AC4(IO_L18P_T2_34) ; port HB1.HB21_N  [project net HB1.HB21_N]
HB1_HB21_P: IC2.AC3(IO_L18N_T2_34) ; port HB1.HB21_P  [project net HB1.HB21_P]
LA1_LA00_CC_N: IC2.K6(IO_L11N_T1_SRCC_36) ; port LA1.LA00_CC_N  [project net LA1.LA00_CC_N]
LA1_LA00_CC_P: IC2.K7(IO_L11P_T1_SRCC_36) ; port LA1.LA00_CC_P  [project net LA1.LA00_CC_P]
LA1_LA01_CC_N: IC2.J5(IO_L14N_T2_SRCC_36) ; port LA1.LA01_CC_N  [project net LA1.LA01_CC_N]
LA1_LA01_CC_P: IC2.J6(IO_L14P_T2_SRCC_36) ; port LA1.LA01_CC_P  [project net LA1.LA01_CC_P]
LA1_LA02_N: IC2.G6(IO_L10N_T1_36) ; port LA1.LA02_N  [project net LA1.LA02_N]
LA1_LA02_P: IC2.G7(IO_L10P_T1_36) ; port LA1.LA02_P  [project net LA1.LA02_P]
LA1_LA03_N: IC2.H1(IO_L22P_T3_36) ; port LA1.LA03_N  [project net LA1.LA03_N]
LA1_LA03_P: IC2.G1(IO_L22N_T3_36) ; port LA1.LA03_P  [project net LA1.LA03_P]
LA1_LA04_N: IC2.K1(IO_L21P_T3_DQS_36) ; port LA1.LA04_N  [project net LA1.LA04_N]
LA1_LA04_P: IC2.J1(IO_L21N_T3_DQS_36) ; port LA1.LA04_P  [project net LA1.LA04_P]
LA1_LA05_N: IC2.H3(IO_L17N_T2_36) ; port LA1.LA05_N  [project net LA1.LA05_N]
LA1_LA05_P: IC2.H4(IO_L17P_T2_36) ; port LA1.LA05_P  [project net LA1.LA05_P]
LA1_LA06_N: IC2.L5(IO_L16P_T2_36) ; port LA1.LA06_N  [project net LA1.LA06_N]
LA1_LA06_P: IC2.K5(IO_L16N_T2_36) ; port LA1.LA06_P  [project net LA1.LA06_P]
LA1_LA07_N: IC2.K2(IO_L24N_T3_36) ; port LA1.LA07_N  [project net LA1.LA07_N]
LA1_LA07_P: IC2.K3(IO_L24P_T3_36) ; port LA1.LA07_P  [project net LA1.LA07_P]
LA1_LA08_N: IC2.F2(IO_L15N_T2_DQS_36) ; port LA1.LA08_N  [project net LA1.LA08_N]
LA1_LA08_P: IC2.F3(IO_L15P_T2_DQS_36) ; port LA1.LA08_P  [project net LA1.LA08_P]
LA1_LA09_N: IC2.J3(IO_L18N_T2_36) ; port LA1.LA09_N  [project net LA1.LA09_N]
LA1_LA09_P: IC2.J4(IO_L18P_T2_36) ; port LA1.LA09_P  [project net LA1.LA09_P]
LA1_LA10_N: IC2.H2(IO_L20P_T3_36) ; port LA1.LA10_N  [project net LA1.LA10_N]
LA1_LA10_P: IC2.G2(IO_L20N_T3_36) ; port LA1.LA10_P  [project net LA1.LA10_P]
LA1_LA11_N: IC2.M2(IO_L23P_T3_36) ; port LA1.LA11_N  [project net LA1.LA11_N]
LA1_LA11_P: IC2.L2(IO_L23N_T3_36) ; port LA1.LA11_P  [project net LA1.LA11_P]
LA1_LA12_N: IC2.L8(IO_L9P_T1_DQS_36) ; port LA1.LA12_N  [project net LA1.LA12_N]
LA1_LA12_P: IC2.K8(IO_L9N_T1_DQS_36) ; port LA1.LA12_P  [project net LA1.LA12_P]
LA1_LA13_N: IC2.G9(IO_L2N_T0_36) ; port LA1.LA13_N  [project net LA1.LA13_N]
LA1_LA13_P: IC2.G10(IO_L2P_T0_36) ; port LA1.LA13_P  [project net LA1.LA13_P]
LA1_LA14_N: IC2.H8(IO_L8N_T1_36) ; port LA1.LA14_N  [project net LA1.LA14_N]
LA1_LA14_P: IC2.H9(IO_L8P_T1_36) ; port LA1.LA14_P  [project net LA1.LA14_P]
LA1_LA15_N: IC2.K11(IO_L3P_T0_DQS_36) ; port LA1.LA15_N  [project net LA1.LA15_N]
LA1_LA15_P: IC2.J11(IO_L3N_T0_DQS_36) ; port LA1.LA15_P  [project net LA1.LA15_P]
LA1_LA16_N: IC2.L9(IO_L5N_T0_36) ; port LA1.LA16_N  [project net LA1.LA16_N]
LA1_LA16_P: IC2.L10(IO_L5P_T0_36) ; port LA1.LA16_P  [project net LA1.LA16_P]
LA1_LA17_CC_N: IC2.T4(IO_L14N_T2_SRCC_35) ; port LA1.LA17_CC_N  [project net LA1.LA17_CC_N]
LA1_LA17_CC_P: IC2.T5(IO_L14P_T2_SRCC_35) ; port LA1.LA17_CC_P  [project net LA1.LA17_CC_P]
LA1_LA18_CC_N: IC2.P3(IO_L11N_T1_SRCC_35) ; port LA1.LA18_CC_N  [project net LA1.LA18_CC_N]
LA1_LA18_CC_P: IC2.P4(IO_L11P_T1_SRCC_35) ; port LA1.LA18_CC_P  [project net LA1.LA18_CC_P]
LA1_LA19_N: IC2.U4(IO_L18N_T2_35) ; port LA1.LA19_N  [project net LA1.LA19_N]
LA1_LA19_P: IC2.U5(IO_L18P_T2_35) ; port LA1.LA19_P  [project net LA1.LA19_P]
LA1_LA20_N: IC2.R10(IO_L20P_T3_35) ; port LA1.LA20_N  [project net LA1.LA20_N]
LA1_LA20_P: IC2.P10(IO_L20N_T3_35) ; port LA1.LA20_P  [project net LA1.LA20_P]
LA1_LA21_N: IC2.M7(IO_L1P_T0_AD4P_35) ; port LA1.LA21_N  [project net LA1.LA21_N]
LA1_LA21_P: IC2.M6(IO_L1N_T0_AD4N_35) ; port LA1.LA21_P  [project net LA1.LA21_P]
LA1_LA22_N: IC2.M4(IO_L8N_T1_AD14N_35) ; port LA1.LA22_N  [project net LA1.LA22_N]
LA1_LA22_P: IC2.M5(IO_L8P_T1_AD14P_35) ; port LA1.LA22_P  [project net LA1.LA22_P]
LA1_LA23_N: IC2.N3(IO_L10P_T1_AD15P_35) ; port LA1.LA23_N  [project net LA1.LA23_N]
LA1_LA23_P: IC2.N2(IO_L10N_T1_AD15N_35) ; port LA1.LA23_P  [project net LA1.LA23_P]
LA1_LA24_N: IC2.M11(IO_L4P_T0_35) ; port LA1.LA24_N  [project net LA1.LA24_N]
LA1_LA24_P: IC2.M10(IO_L4N_T0_35) ; port LA1.LA24_P  [project net LA1.LA24_P]
LA1_LA25_N: IC2.N8(IO_L3P_T0_DQS_AD5P_35) ; port LA1.LA25_N  [project net LA1.LA25_N]
LA1_LA25_P: IC2.N7(IO_L3N_T0_DQS_AD5N_35) ; port LA1.LA25_P  [project net LA1.LA25_P]
LA1_LA26_N: IC2.T2(IO_L17N_T2_35) ; port LA1.LA26_N  [project net LA1.LA26_N]
LA1_LA26_P: IC2.T3(IO_L17P_T2_35) ; port LA1.LA26_P  [project net LA1.LA26_P]
LA1_LA27_N: IC2.R2(IO_L15N_T2_DQS_35) ; port LA1.LA27_N  [project net LA1.LA27_N]
LA1_LA27_P: IC2.R3(IO_L15P_T2_DQS_35) ; port LA1.LA27_P  [project net LA1.LA27_P]
LA1_LA28_N: IC2.T7(IO_L23N_T3_35) ; port LA1.LA28_N  [project net LA1.LA28_N]
LA1_LA28_P: IC2.T8(IO_L23P_T3_35) ; port LA1.LA28_P  [project net LA1.LA28_P]
LA1_LA29_N: IC2.P9(IO_L5P_T0_AD13P_35) ; port LA1.LA29_N  [project net LA1.LA29_N]
LA1_LA29_P: IC2.P8(IO_L5N_T0_AD13N_35) ; port LA1.LA29_P  [project net LA1.LA29_P]
LA1_LA30_N: IC2.M1(IO_L7N_T1_AD6N_35) ; port LA1.LA30_N  [project net LA1.LA30_N]
LA1_LA30_P: IC2.N1(IO_L7P_T1_AD6P_35) ; port LA1.LA30_P  [project net LA1.LA30_P]
LA1_LA31_N: IC2.U7(IO_L22P_T3_35) ; port LA1.LA31_N  [project net LA1.LA31_N]
LA1_LA31_P: IC2.U6(IO_L22N_T3_35) ; port LA1.LA31_P  [project net LA1.LA31_P]
LA1_LA32_N: IC2.P1(IO_L9N_T1_DQS_AD7N_35) ; port LA1.LA32_N  [project net LA1.LA32_N]
LA1_LA32_P: IC2.R1(IO_L9P_T1_DQS_AD7P_35) ; port LA1.LA32_P  [project net LA1.LA32_P]
LA1_LA33_N: IC2.U2(IO_L16P_T2_35) ; port LA1.LA33_N  [project net LA1.LA33_N]
LA1_LA33_P: IC2.U1(IO_L16N_T2_35) ; port LA1.LA33_P  [project net LA1.LA33_P]
LA1_LAXX_SPARE0_N: IC2.N9(IO_L2P_T0_AD12P_35)
LA1_LAXX_SPARE0_P: IC2.M9(IO_L2N_T0_AD12N_35)
LA1_LAXX_SPARE1_N: IC2.L12(IO_L1P_T0_36)
LA1_LAXX_SPARE1_P: IC2.K12(IO_L1N_T0_36)
LA1_LAXX_SPARE3_N: IC2.U9(IO_L24P_T3_35)
LA1_LAXX_SPARE3_P: IC2.T9(IO_L24N_T3_35)
LA1_LAXX_SPARE5_N: IC2.T10(IO_L21N_T3_DQS_35)
LA1_LAXX_SPARE5_P: IC2.U10(IO_L21P_T3_DQS_35)
LA1_LAXX_SPARE6_N: IC2.G11(IO_L4N_T0_36)
LA1_LAXX_SPARE6_P: IC2.H11(IO_L4P_T0_36)
LED_B: IC2.H12(IO_0_36) Q11.1(G) R282.2
LED_BD: Q11.3(D) R279.1
LED_BR: LD1.3(AB) R279.2
LED_G: IC2.L7(IO_25_36) Q10.1(G) R281.2
LED_GD: Q10.3(D) R278.1
LED_GR: LD1.2(AG) R278.2
LED_LR: LD1.1(AR) R277.2
LED_R: IC2.K10(IO_L6P_T0_36) Q7.1(G) R280.2
LED_RD: Q7.3(D) R277.1

Not connected (* = marked no-connect by the designer): IC2 AA8(IO_L19P_T3_34) AB11(IO_25_34) L4(IO_L19P_T3_36) L23(IO_0_16) M26(IO_25_16) R8(IO_L19P_T3_35) U11(IO_25_35) W6(IO_L6P_T0_34) Y11(IO_0_34)

### Layout directives
differential pair: CLKS1.CLK0_M2C_N, CLKS1.CLK0_M2C_P, CLKS1.CLK1_M2C_N, CLKS1.CLK1_M2C_P, CLKS1.CLK2_BIDIR_N, CLKS1.CLK2_BIDIR_P, CLKS1.CLK3_BIDIR_N, CLKS1.CLK3_BIDIR_P, HA1.HA00_CC_N, HA1.HA00_CC_P, HA1.HA01_CC_N, HA1.HA01_CC_P, HA1.HA02_N, HA1.HA02_P, HA1.HA03_N, HA1.HA03_P, HA1.HA04_N, HA1.HA04_P, HA1.HA05_N, HA1.HA05_P, HA1.HA06_N, HA1.HA06_P, HA1.HA07_N, HA1.HA07_P, HA1.HA08_N, HA1.HA08_P, HA1.HA09_N, HA1.HA09_P, HA1.HA10_N, HA1.HA10_P, HA1.HA11_N, HA1.HA11_P, HA1.HA12_N, HA1.HA12_P, HA1.HA13_N, HA1.HA13_P, HA1.HA14_N, HA1.HA14_P, HA1.HA15_N, HA1.HA15_P, HA1.HA16_N, HA1.HA16_P, HA1.HA17_CC_N, HA1.HA17_CC_P, HA1.HA18_N, HA1.HA18_P, HA1.HA19_N, HA1.HA19_P, HA1.HA20_N, HA1.HA20_P, HA1.HA21_N, HA1.HA21_P, HA1.HA22_N, HA1.HA22_P, HA1.HA23_N, HA1.HA23_P, HB1.HB00_CC_N, HB1.HB00_CC_P, HB1.HB01_N, HB1.HB01_P, HB1.HB02_N, HB1.HB02_P, HB1.HB03_N, HB1.HB03_P, HB1.HB04_N, HB1.HB04_P, HB1.HB05_N, HB1.HB05_P, HB1.HB06_CC_N, HB1.HB06_CC_P, HB1.HB07_N, HB1.HB07_P, HB1.HB08_N, HB1.HB08_P, HB1.HB09_N, HB1.HB09_P, HB1.HB10_N, HB1.HB10_P, HB1.HB11_N, HB1.HB11_P, HB1.HB12_N, HB1.HB12_P, HB1.HB13_N, HB1.HB13_P, HB1.HB14_N, HB1.HB14_P, HB1.HB15_N, HB1.HB15_P, HB1.HB16_N, HB1.HB16_P, HB1.HB17_CC_N, HB1.HB17_CC_P, HB1.HB18_N, HB1.HB18_P, HB1.HB19_N, HB1.HB19_P, HB1.HB20_N, HB1.HB20_P, HB1.HB21_N, HB1.HB21_P, LA1.LA00_CC_N, LA1.LA00_CC_P, LA1.LA01_CC_N, LA1.LA01_CC_P, LA1.LA02_N, LA1.LA02_P, LA1.LA03_N, LA1.LA03_P, LA1.LA04_N, LA1.LA04_P, LA1.LA05_N, LA1.LA05_P, LA1.LA06_N, LA1.LA06_P, LA1.LA07_N, LA1.LA07_P, LA1.LA08_N, LA1.LA08_P, LA1.LA09_N, LA1.LA09_P, LA1.LA10_N, LA1.LA10_P, LA1.LA11_N, LA1.LA11_P, LA1.LA12_N, LA1.LA12_P, LA1.LA13_N, LA1.LA13_P, LA1.LA14_N, LA1.LA14_P, LA1.LA15_N, LA1.LA15_P, LA1.LA16_N, LA1.LA16_P, LA1.LA17_CC_N, LA1.LA17_CC_P, LA1.LA18_CC_N, LA1.LA18_CC_P, LA1.LA19_N, LA1.LA19_P, LA1.LA20_N, LA1.LA20_P, LA1.LA21_N, LA1.LA21_P, LA1.LA22_N, LA1.LA22_P, LA1.LA23_N, LA1.LA23_P, LA1.LA24_N, LA1.LA24_P, LA1.LA25_N, LA1.LA25_P, LA1.LA26_N, LA1.LA26_P, LA1.LA27_N, LA1.LA27_P, LA1.LA28_N, LA1.LA28_P, LA1.LA29_N, LA1.LA29_P, LA1.LA30_N, LA1.LA30_P, LA1.LA31_N, LA1.LA31_P, LA1.LA32_N, LA1.LA32_P, LA1.LA33_N, LA1.LA33_P, LA1_LAXX_SPARE0_N, LA1_LAXX_SPARE0_P, LA1_LAXX_SPARE1_N, LA1_LAXX_SPARE1_P, LA1_LAXX_SPARE3_N, LA1_LAXX_SPARE3_P, LA1_LAXX_SPARE5_N, LA1_LAXX_SPARE5_P, LA1_LAXX_SPARE6_N, LA1_LAXX_SPARE6_P
net class FMC1: CLKS1_CLK0_M2C_N, CLKS1_CLK0_M2C_P, CLKS1_CLK1_M2C_N, CLKS1_CLK1_M2C_P, CLKS1_CLK2_BIDIR_N, CLKS1_CLK2_BIDIR_P, CLKS1_CLK3_BIDIR_N, CLKS1_CLK3_BIDIR_P, FMC1_VREF_A_M2C, FMC1_VREF_B_M2C, HA1_HA00_CC_N, HA1_HA00_CC_P, HA1_HA01_CC_N, HA1_HA01_CC_P, HA1_HA02_N, HA1_HA02_P, HA1_HA03_N, HA1_HA03_P, HA1_HA04_N, HA1_HA04_P, HA1_HA05_N, HA1_HA05_P, HA1_HA06_N, HA1_HA06_P, HA1_HA07_N, HA1_HA07_P, HA1_HA08_N, HA1_HA08_P, HA1_HA09_N, HA1_HA09_P, HA1_HA10_N, HA1_HA10_P, HA1_HA11_N, HA1_HA11_P, HA1_HA12_N, HA1_HA12_P, HA1_HA13_N, HA1_HA13_P, HA1_HA14_N, HA1_HA14_P, HA1_HA15_N, HA1_HA15_P, HA1_HA16_N, HA1_HA16_P, HA1_HA17_CC_N, HA1_HA17_CC_P, HA1_HA18_N, HA1_HA18_P, HA1_HA19_N, HA1_HA19_P, HA1_HA20_N, HA1_HA20_P, HA1_HA21_N, HA1_HA21_P, HA1_HA22_N, HA1_HA22_P, HA1_HA23_N, HA1_HA23_P, HB1_HB00_CC_N, HB1_HB00_CC_P, HB1_HB01_N, HB1_HB01_P, HB1_HB02_N, HB1_HB02_P, HB1_HB03_N, HB1_HB03_P, HB1_HB04_N, HB1_HB04_P, HB1_HB05_N, HB1_HB05_P, HB1_HB06_CC_N, HB1_HB06_CC_P, HB1_HB07_N, HB1_HB07_P, HB1_HB08_N, HB1_HB08_P, HB1_HB09_N, HB1_HB09_P, HB1_HB10_N, HB1_HB10_P, HB1_HB11_N, HB1_HB11_P, HB1_HB12_N, HB1_HB12_P, HB1_HB13_N, HB1_HB13_P, HB1_HB14_N, HB1_HB14_P, HB1_HB15_N, HB1_HB15_P, HB1_HB16_N, HB1_HB16_P, HB1_HB17_CC_N, HB1_HB17_CC_P, HB1_HB18_N, HB1_HB18_P, HB1_HB19_N, HB1_HB19_P, HB1_HB20_N, HB1_HB20_P, HB1_HB21_N, HB1_HB21_P, LA1_LA00_CC_N, LA1_LA00_CC_P, LA1_LA01_CC_N, LA1_LA01_CC_P, LA1_LA02_N, LA1_LA02_P, LA1_LA03_N, LA1_LA03_P, LA1_LA04_N, LA1_LA04_P, LA1_LA05_N, LA1_LA05_P, LA1_LA06_N, LA1_LA06_P, LA1_LA07_N, LA1_LA07_P, LA1_LA08_N, LA1_LA08_P, LA1_LA09_N, LA1_LA09_P, LA1_LA10_N, LA1_LA10_P, LA1_LA11_N, LA1_LA11_P, LA1_LA12_N, LA1_LA12_P, LA1_LA13_N, LA1_LA13_P, LA1_LA14_N, LA1_LA14_P, LA1_LA15_N, LA1_LA15_P, LA1_LA16_N, LA1_LA16_P, LA1_LA17_CC_N, LA1_LA17_CC_P, LA1_LA18_CC_N, LA1_LA18_CC_P, LA1_LA19_N, LA1_LA19_P, LA1_LA20_N, LA1_LA20_P, LA1_LA21_N, LA1_LA21_P, LA1_LA22_N, LA1_LA22_P, LA1_LA23_N, LA1_LA23_P, LA1_LA24_N, LA1_LA24_P, LA1_LA25_N, LA1_LA25_P, LA1_LA26_N, LA1_LA26_P, LA1_LA27_N, LA1_LA27_P, LA1_LA28_N, LA1_LA28_P, LA1_LA29_N, LA1_LA29_P, LA1_LA30_N, LA1_LA30_P, LA1_LA31_N, LA1_LA31_P, LA1_LA32_N, LA1_LA32_P, LA1_LA33_N, LA1_LA33_P, LA1_LAXX_SPARE0_N, LA1_LAXX_SPARE0_P, LA1_LAXX_SPARE1_N, LA1_LAXX_SPARE1_P, LA1_LAXX_SPARE2_N, LA1_LAXX_SPARE2_P, LA1_LAXX_SPARE3_N, LA1_LAXX_SPARE3_P, LA1_LAXX_SPARE5_N, LA1_LAXX_SPARE5_P, LA1_LAXX_SPARE6_N, LA1_LAXX_SPARE6_P
net class POWER: FMC1_VREF_A_M2C, FMC1_VREF_B_M2C
net class SE60DE100: CLKS1_CLK0_M2C_N, CLKS1_CLK0_M2C_P, CLKS1_CLK1_M2C_N, CLKS1_CLK1_M2C_P, CLKS1_CLK2_BIDIR_N, CLKS1_CLK2_BIDIR_P, CLKS1_CLK3_BIDIR_N, CLKS1_CLK3_BIDIR_P, HA1_HA00_CC_N, HA1_HA00_CC_P, HA1_HA01_CC_N, HA1_HA01_CC_P, HA1_HA02_N, HA1_HA02_P, HA1_HA03_N, HA1_HA03_P, HA1_HA04_N, HA1_HA04_P, HA1_HA05_N, HA1_HA05_P, HA1_HA06_N, HA1_HA06_P, HA1_HA07_N, HA1_HA07_P, HA1_HA08_N, HA1_HA08_P, HA1_HA09_N, HA1_HA09_P, HA1_HA10_N, HA1_HA10_P, HA1_HA11_N, HA1_HA11_P, HA1_HA12_N, HA1_HA12_P, HA1_HA13_N, HA1_HA13_P, HA1_HA14_N, HA1_HA14_P, HA1_HA15_N, HA1_HA15_P, HA1_HA16_N, HA1_HA16_P, HA1_HA17_CC_N, HA1_HA17_CC_P, HA1_HA18_N, HA1_HA18_P, HA1_HA19_N, HA1_HA19_P, HA1_HA20_N, HA1_HA20_P, HA1_HA21_N, HA1_HA21_P, HA1_HA22_N, HA1_HA22_P, HA1_HA23_N, HA1_HA23_P, HB1_HB00_CC_N, HB1_HB00_CC_P, HB1_HB01_N, HB1_HB01_P, HB1_HB02_N, HB1_HB02_P, HB1_HB03_N, HB1_HB03_P, HB1_HB04_N, HB1_HB04_P, HB1_HB05_N, HB1_HB05_P, HB1_HB06_CC_N, HB1_HB06_CC_P, HB1_HB07_N, HB1_HB07_P, HB1_HB08_N, HB1_HB08_P, HB1_HB09_N, HB1_HB09_P, HB1_HB10_N, HB1_HB10_P, HB1_HB11_N, HB1_HB11_P, HB1_HB12_N, HB1_HB12_P, HB1_HB13_N, HB1_HB13_P, HB1_HB14_N, HB1_HB14_P, HB1_HB15_N, HB1_HB15_P, HB1_HB16_N, HB1_HB16_P, HB1_HB17_CC_N, HB1_HB17_CC_P, HB1_HB18_N, HB1_HB18_P, HB1_HB19_N, HB1_HB19_P, HB1_HB20_N, HB1_HB20_P, HB1_HB21_N, HB1_HB21_P, LA1_LA00_CC_N, LA1_LA00_CC_P, LA1_LA01_CC_N, LA1_LA01_CC_P, LA1_LA02_N, LA1_LA02_P, LA1_LA03_N, LA1_LA03_P, LA1_LA04_N, LA1_LA04_P, LA1_LA05_N, LA1_LA05_P, LA1_LA06_N, LA1_LA06_P, LA1_LA07_N, LA1_LA07_P, LA1_LA08_N, LA1_LA08_P, LA1_LA09_N, LA1_LA09_P, LA1_LA10_N, LA1_LA10_P, LA1_LA11_N, LA1_LA11_P, LA1_LA12_N, LA1_LA12_P, LA1_LA13_N, LA1_LA13_P, LA1_LA14_N, LA1_LA14_P, LA1_LA15_N, LA1_LA15_P, LA1_LA16_N, LA1_LA16_P, LA1_LA17_CC_N, LA1_LA17_CC_P, LA1_LA18_CC_N, LA1_LA18_CC_P, LA1_LA19_N, LA1_LA19_P, LA1_LA20_N, LA1_LA20_P, LA1_LA21_N, LA1_LA21_P, LA1_LA22_N, LA1_LA22_P, LA1_LA23_N, LA1_LA23_P, LA1_LA24_N, LA1_LA24_P, LA1_LA25_N, LA1_LA25_P, LA1_LA26_N, LA1_LA26_P, LA1_LA27_N, LA1_LA27_P, LA1_LA28_N, LA1_LA28_P, LA1_LA29_N, LA1_LA29_P, LA1_LA30_N, LA1_LA30_P, LA1_LA31_N, LA1_LA31_P, LA1_LA32_N, LA1_LA32_P, LA1_LA33_N, LA1_LA33_P, LA1_LAXX_SPARE0_N, LA1_LAXX_SPARE0_P, LA1_LAXX_SPARE1_N, LA1_LAXX_SPARE1_P, LA1_LAXX_SPARE2_N, LA1_LAXX_SPARE2_P, LA1_LAXX_SPARE3_N, LA1_LAXX_SPARE3_P, LA1_LAXX_SPARE5_N, LA1_LAXX_SPARE5_P, LA1_LAXX_SPARE6_N, LA1_LAXX_SPARE6_P
net class DE_SIG: CLKS1_CLK0_M2C_N, CLKS1_CLK0_M2C_P, CLKS1_CLK1_M2C_N, CLKS1_CLK1_M2C_P, CLKS1_CLK2_BIDIR_N, CLKS1_CLK2_BIDIR_P, CLKS1_CLK3_BIDIR_N, CLKS1_CLK3_BIDIR_P, HA1_HA00_CC_N, HA1_HA00_CC_P, HA1_HA01_CC_N, HA1_HA01_CC_P, HA1_HA02_N, HA1_HA02_P, HA1_HA03_N, HA1_HA03_P, HA1_HA04_N, HA1_HA04_P, HA1_HA05_N, HA1_HA05_P, HA1_HA06_N, HA1_HA06_P, HA1_HA07_N, HA1_HA07_P, HA1_HA08_N, HA1_HA08_P, HA1_HA09_N, HA1_HA09_P, HA1_HA10_N, HA1_HA10_P, HA1_HA11_N, HA1_HA11_P, HA1_HA12_N, HA1_HA12_P, HA1_HA13_N, HA1_HA13_P, HA1_HA14_N, HA1_HA14_P, HA1_HA15_N, HA1_HA15_P, HA1_HA16_N, HA1_HA16_P, HA1_HA17_CC_N, HA1_HA17_CC_P, HA1_HA18_N, HA1_HA18_P, HA1_HA19_N, HA1_HA19_P, HA1_HA20_N, HA1_HA20_P, HA1_HA21_N, HA1_HA21_P, HA1_HA22_N, HA1_HA22_P, HA1_HA23_N, HA1_HA23_P, HB1_HB00_CC_N, HB1_HB00_CC_P, HB1_HB01_N, HB1_HB01_P, HB1_HB02_N, HB1_HB02_P, HB1_HB03_N, HB1_HB03_P, HB1_HB04_N, HB1_HB04_P, HB1_HB05_N, HB1_HB05_P, HB1_HB06_CC_N, HB1_HB06_CC_P, HB1_HB07_N, HB1_HB07_P, HB1_HB08_N, HB1_HB08_P, HB1_HB09_N, HB1_HB09_P, HB1_HB10_N, HB1_HB10_P, HB1_HB11_N, HB1_HB11_P, HB1_HB12_N, HB1_HB12_P, HB1_HB13_N, HB1_HB13_P, HB1_HB14_N, HB1_HB14_P, HB1_HB15_N, HB1_HB15_P, HB1_HB16_N, HB1_HB16_P, HB1_HB17_CC_N, HB1_HB17_CC_P, HB1_HB18_N, HB1_HB18_P, HB1_HB19_N, HB1_HB19_P, HB1_HB20_N, HB1_HB20_P, HB1_HB21_N, HB1_HB21_P, LA1_LA00_CC_N, LA1_LA00_CC_P, LA1_LA01_CC_N, LA1_LA01_CC_P, LA1_LA02_N, LA1_LA02_P, LA1_LA03_N, LA1_LA03_P, LA1_LA04_N, LA1_LA04_P, LA1_LA05_N, LA1_LA05_P, LA1_LA06_N, LA1_LA06_P, LA1_LA07_N, LA1_LA07_P, LA1_LA08_N, LA1_LA08_P, LA1_LA09_N, LA1_LA09_P, LA1_LA10_N, LA1_LA10_P, LA1_LA11_N, LA1_LA11_P, LA1_LA12_N, LA1_LA12_P, LA1_LA13_N, LA1_LA13_P, LA1_LA14_N, LA1_LA14_P, LA1_LA15_N, LA1_LA15_P, LA1_LA16_N, LA1_LA16_P, LA1_LA17_CC_N, LA1_LA17_CC_P, LA1_LA18_CC_N, LA1_LA18_CC_P, LA1_LA19_N, LA1_LA19_P, LA1_LA20_N, LA1_LA20_P, LA1_LA21_N, LA1_LA21_P, LA1_LA22_N, LA1_LA22_P, LA1_LA23_N, LA1_LA23_P, LA1_LA24_N, LA1_LA24_P, LA1_LA25_N, LA1_LA25_P, LA1_LA26_N, LA1_LA26_P, LA1_LA27_N, LA1_LA27_P, LA1_LA28_N, LA1_LA28_P, LA1_LA29_N, LA1_LA29_P, LA1_LA30_N, LA1_LA30_P, LA1_LA31_N, LA1_LA31_P, LA1_LA32_N, LA1_LA32_P, LA1_LA33_N, LA1_LA33_P, LA1_LAXX_SPARE0_N, LA1_LAXX_SPARE0_P, LA1_LAXX_SPARE1_N, LA1_LAXX_SPARE1_P, LA1_LAXX_SPARE2_N, LA1_LAXX_SPARE2_P, LA1_LAXX_SPARE3_N, LA1_LAXX_SPARE3_P, LA1_LAXX_SPARE5_N, LA1_LAXX_SPARE5_P, LA1_LAXX_SPARE6_N, LA1_LAXX_SPARE6_P
net class FMC1_LA: LA1_LA00_CC_N, LA1_LA00_CC_P, LA1_LA01_CC_N, LA1_LA01_CC_P, LA1_LA02_N, LA1_LA02_P, LA1_LA03_N, LA1_LA03_P, LA1_LA04_N, LA1_LA04_P, LA1_LA05_N, LA1_LA05_P, LA1_LA06_N, LA1_LA06_P, LA1_LA07_N, LA1_LA07_P, LA1_LA08_N, LA1_LA08_P, LA1_LA09_N, LA1_LA09_P, LA1_LA10_N, LA1_LA10_P, LA1_LA11_N, LA1_LA11_P, LA1_LA12_N, LA1_LA12_P, LA1_LA13_N, LA1_LA13_P, LA1_LA14_N, LA1_LA14_P, LA1_LA15_N, LA1_LA15_P, LA1_LA16_N, LA1_LA16_P, LA1_LA17_CC_N, LA1_LA17_CC_P, LA1_LA18_CC_N, LA1_LA18_CC_P, LA1_LA19_N, LA1_LA19_P, LA1_LA20_N, LA1_LA20_P, LA1_LA21_N, LA1_LA21_P, LA1_LA22_N, LA1_LA22_P, LA1_LA23_N, LA1_LA23_P, LA1_LA24_N, LA1_LA24_P, LA1_LA25_N, LA1_LA25_P, LA1_LA26_N, LA1_LA26_P, LA1_LA27_N, LA1_LA27_P, LA1_LA28_N, LA1_LA28_P, LA1_LA29_N, LA1_LA29_P, LA1_LA30_N, LA1_LA30_P, LA1_LA31_N, LA1_LA31_P, LA1_LA32_N, LA1_LA32_P, LA1_LA33_N, LA1_LA33_P, LA1_LAXX_SPARE0_N, LA1_LAXX_SPARE0_P, LA1_LAXX_SPARE1_N, LA1_LAXX_SPARE1_P, LA1_LAXX_SPARE2_N, LA1_LAXX_SPARE2_P, LA1_LAXX_SPARE3_N, LA1_LAXX_SPARE3_P, LA1_LAXX_SPARE5_N, LA1_LAXX_SPARE5_P, LA1_LAXX_SPARE6_N, LA1_LAXX_SPARE6_P
net class FMC1_HA: HA1_HA00_CC_N, HA1_HA00_CC_P, HA1_HA01_CC_N, HA1_HA01_CC_P, HA1_HA02_N, HA1_HA02_P, HA1_HA03_N, HA1_HA03_P, HA1_HA04_N, HA1_HA04_P, HA1_HA05_N, HA1_HA05_P, HA1_HA06_N, HA1_HA06_P, HA1_HA07_N, HA1_HA07_P, HA1_HA08_N, HA1_HA08_P, HA1_HA09_N, HA1_HA09_P, HA1_HA10_N, HA1_HA10_P, HA1_HA11_N, HA1_HA11_P, HA1_HA12_N, HA1_HA12_P, HA1_HA13_N, HA1_HA13_P, HA1_HA14_N, HA1_HA14_P, HA1_HA15_N, HA1_HA15_P, HA1_HA16_N, HA1_HA16_P, HA1_HA17_CC_N, HA1_HA17_CC_P, HA1_HA18_N, HA1_HA18_P, HA1_HA19_N, HA1_HA19_P, HA1_HA20_N, HA1_HA20_P, HA1_HA21_N, HA1_HA21_P, HA1_HA22_N, HA1_HA22_P, HA1_HA23_N, HA1_HA23_P
net class FMC1_HB: HB1_HB00_CC_N, HB1_HB00_CC_P, HB1_HB01_N, HB1_HB01_P, HB1_HB02_N, HB1_HB02_P, HB1_HB03_N, HB1_HB03_P, HB1_HB04_N, HB1_HB04_P, HB1_HB05_N, HB1_HB05_P, HB1_HB06_CC_N, HB1_HB06_CC_P, HB1_HB07_N, HB1_HB07_P, HB1_HB08_N, HB1_HB08_P, HB1_HB09_N, HB1_HB09_P, HB1_HB10_N, HB1_HB10_P, HB1_HB11_N, HB1_HB11_P, HB1_HB12_N, HB1_HB12_P, HB1_HB13_N, HB1_HB13_P, HB1_HB14_N, HB1_HB14_P, HB1_HB15_N, HB1_HB15_P, HB1_HB16_N, HB1_HB16_P, HB1_HB17_CC_N, HB1_HB17_CC_P, HB1_HB18_N, HB1_HB18_P, HB1_HB19_N, HB1_HB19_P, HB1_HB20_N, HB1_HB20_P, HB1_HB21_N, HB1_HB21_P
net class FMC1_REST: CLKS1_CLK0_M2C_N, CLKS1_CLK0_M2C_P, CLKS1_CLK1_M2C_N, CLKS1_CLK1_M2C_P, CLKS1_CLK2_BIDIR_N, CLKS1_CLK2_BIDIR_P, CLKS1_CLK3_BIDIR_N, CLKS1_CLK3_BIDIR_P, FMC1_VREF_A_M2C, FMC1_VREF_B_M2C
net class BANK_16: HA1_HA00_CC_N, HA1_HA00_CC_P, HA1_HA01_CC_N, HA1_HA01_CC_P, HA1_HA02_N, HA1_HA02_P, HA1_HA03_N, HA1_HA03_P, HA1_HA04_N, HA1_HA04_P, HA1_HA05_N, HA1_HA05_P, HA1_HA06_N, HA1_HA06_P, HA1_HA07_N, HA1_HA07_P, HA1_HA08_N, HA1_HA08_P, HA1_HA09_N, HA1_HA09_P, HA1_HA10_N, HA1_HA10_P, HA1_HA11_N, HA1_HA11_P, HA1_HA12_N, HA1_HA12_P, HA1_HA13_N, HA1_HA13_P, HA1_HA14_N, HA1_HA14_P, HA1_HA15_N, HA1_HA15_P, HA1_HA16_N, HA1_HA16_P, HA1_HA17_CC_N, HA1_HA17_CC_P, HA1_HA18_N, HA1_HA18_P, HA1_HA19_N, HA1_HA19_P, HA1_HA20_N, HA1_HA20_P, HA1_HA21_N, HA1_HA21_P, HA1_HA22_N, HA1_HA22_P, HA1_HA23_N, HA1_HA23_P
net class BANK_34: FMC1_VREF_B_M2C, HB1_HB00_CC_N, HB1_HB00_CC_P, HB1_HB01_N, HB1_HB01_P, HB1_HB02_N, HB1_HB02_P, HB1_HB03_N, HB1_HB03_P, HB1_HB04_N, HB1_HB04_P, HB1_HB05_N, HB1_HB05_P, HB1_HB06_CC_N, HB1_HB06_CC_P, HB1_HB07_N, HB1_HB07_P, HB1_HB08_N, HB1_HB08_P, HB1_HB09_N, HB1_HB09_P, HB1_HB10_N, HB1_HB10_P, HB1_HB11_N, HB1_HB11_P, HB1_HB12_N, HB1_HB12_P, HB1_HB13_N, HB1_HB13_P, HB1_HB14_N, HB1_HB14_P, HB1_HB15_N, HB1_HB15_P, HB1_HB16_N, HB1_HB16_P, HB1_HB17_CC_N, HB1_HB17_CC_P, HB1_HB18_N, HB1_HB18_P, HB1_HB19_N, HB1_HB19_P, HB1_HB20_N, HB1_HB20_P, HB1_HB21_N, HB1_HB21_P
net class BANK_35: CLKS1_CLK1_M2C_N, CLKS1_CLK1_M2C_P, CLKS1_CLK3_BIDIR_N, CLKS1_CLK3_BIDIR_P, FMC1_VREF_A_M2C, FPGA_I2C_SCL, FPGA_I2C_SDA, LA1_LA17_CC_N, LA1_LA17_CC_P, LA1_LA18_CC_N, LA1_LA18_CC_P, LA1_LA19_N, LA1_LA19_P, LA1_LA20_N, LA1_LA20_P, LA1_LA21_N, LA1_LA21_P, LA1_LA22_N, LA1_LA22_P, LA1_LA23_N, LA1_LA23_P, LA1_LA24_N, LA1_LA24_P, LA1_LA25_N, LA1_LA25_P, LA1_LA26_N, LA1_LA26_P, LA1_LA27_N, LA1_LA27_P, LA1_LA28_N, LA1_LA28_P, LA1_LA29_N, LA1_LA29_P, LA1_LA30_N, LA1_LA30_P, LA1_LA31_N, LA1_LA31_P, LA1_LA32_N, LA1_LA32_P, LA1_LA33_N, LA1_LA33_P, LA1_LAXX_SPARE0_N, LA1_LAXX_SPARE0_P, LA1_LAXX_SPARE3_N, LA1_LAXX_SPARE3_P, LA1_LAXX_SPARE5_N, LA1_LAXX_SPARE5_P
net class BANK_36: CLKS1_CLK0_M2C_N, CLKS1_CLK0_M2C_P, CLKS1_CLK2_BIDIR_N, CLKS1_CLK2_BIDIR_P, FLASH_CLK, FLASH_CSn, FMC1_VREF_A_M2C, LA1_LA00_CC_N, LA1_LA00_CC_P, LA1_LA01_CC_N, LA1_LA01_CC_P, LA1_LA02_N, LA1_LA02_P, LA1_LA03_N, LA1_LA03_P, LA1_LA04_N, LA1_LA04_P, LA1_LA05_N, LA1_LA05_P, LA1_LA06_N, LA1_LA06_P, LA1_LA07_N, LA1_LA07_P, LA1_LA08_N, LA1_LA08_P, LA1_LA09_N, LA1_LA09_P, LA1_LA10_N, LA1_LA10_P, LA1_LA11_N, LA1_LA11_P, LA1_LA12_N, LA1_LA12_P, LA1_LA13_N, LA1_LA13_P, LA1_LA14_N, LA1_LA14_P, LA1_LA15_N, LA1_LA15_P, LA1_LA16_N, LA1_LA16_P, LA1_LAXX_SPARE1_N, LA1_LAXX_SPARE1_P, LA1_LAXX_SPARE6_N, LA1_LAXX_SPARE6_P, LED_B, LED_G, LED_R
net class FMC1_LA_CC: LA1_LA00_CC_N, LA1_LA00_CC_P, LA1_LA01_CC_N, LA1_LA01_CC_P, LA1_LA17_CC_N, LA1_LA17_CC_P, LA1_LA18_CC_N, LA1_LA18_CC_P
net class FMC1_HA_CC: HA1_HA00_CC_N, HA1_HA00_CC_P, HA1_HA01_CC_N, HA1_HA01_CC_P, HA1_HA17_CC_N, HA1_HA17_CC_P
net class FMC1_HB_CC: HB1_HB00_CC_N, HB1_HB00_CC_P, HB1_HB06_CC_N, HB1_HB06_CC_P, HB1_HB17_CC_N, HB1_HB17_CC_P
net class FMC1_CLKS: CLKS1_CLK0_M2C_N, CLKS1_CLK0_M2C_P, CLKS1_CLK1_M2C_N, CLKS1_CLK1_M2C_P, CLKS1_CLK2_BIDIR_N, CLKS1_CLK2_BIDIR_P, CLKS1_CLK3_BIDIR_N, CLKS1_CLK3_BIDIR_P

### Notes on the sheet
- Copyright LNLS 2012.
  This documentation describes Open Hardware and is licensed under the CERN OHL v.1.1. You may redistribute and modify this documentation under the terms of the CERN OHL v.1.1. (http://ohwr.org/CERNOHL). This documentation is distributed WITHOUT ANY EXPRESS OR IMPLIED WARRANTY, INCLUDING OF MERCHANTABILITY, SATISFACTORY QUALITY AND FITNESS FOR A PARTICULAR PURPOSE. Please see the CERN OHL v.1.1 for applicable conditions.
- Bank Migrated
- Labels drawn without touching a wire or pin: HB1_HB08_N, HB1_HB09_N
- (in symbol LED_OPTEK_OVSRRGBCC3_a) R; G; B
- (in symbol XC7A350T-2FFG1156C, part E) BANK 16
- (in symbol XC7A350T-2FFG1156C, part I) BANK 34
- (in symbol XC7A350T-2FFG1156C, part J) BANK 35
- (in symbol XC7A350T-2FFG1156C, part K) BANK 36

### Library data of the parts
C99 C100 C102 C111 C112 C114 C118 C120 C121 = CAP_SMD_0201: Capacitor SMD
IC2 = XC7A350T-2FFG1156C: Artix-6 FPGA, 16 GTPs, 600 User I/Os, 1156-Pin BGA, Speed Grade 2, Commercial Grade, Pb-Free; Part Description: Artix-7 FPGA, 16 GTPs, 600 User I/Os, 1156-Pin BGA, Speed Grade 2, Commercial Grade, Pb-Free; Manufacturer: XILINX; Table: Logic; Part Number: XC7A350T-2FFG1156C; Component Kind: Standard; Component Type: Standard; Device: XC7A350T-2FFG1156C; PackageDescription: BGA, 1.00mm Pitch, Square; 1156 Pin, 34 Columns X 34 Rows, 35.00mm X 35.00mm X 3.350mm H; Manufacturer Part Number: XC7A350T-2FFG1156C; Pin Count: 1156; Case: BGA1156; Mounted: Yes; Socket: No; SMD: Yes; ComponentHeight: 3.35mm; HelpURL: \\cern.ch\dfs\Applications\Altium\Datasheets\XC7A350T-2FFG1156C.pdf; ComponentLink1URL: \\cern.ch\dfs\Applications\Altium\Datasheets\XC7A350T-2FFG1156C.pdf; ComponentLink1Description: Package/Pinout; Author: CERN DEM JLC; CreateDate: 2012-09-19; LatestRevisionDate: 2012-09-19
IC56 = IFC_PCA9306: I2C BUS VOLTAGE-LEVEL TRANSLATOR
LD1 = LED_OPTEK_OVSRRGBCC3_a: Right Angle Tricolor (RGB) Surface Mount LED, Body 3.2x1mm; Part Description: Side Mount, Full-Color (RGB), 1204 Surface Mount LED (150° Viewing Angle); Manufacturer: OPTEK / TT ELECTRONICS; Table: LEDs & Displays; Part Number: LED_OPTEK_OVSRRGBCC3_a; Component Kind: Standard; Component Type: Standard; Color: Red/Green/Blue; PackageDescription: Side Mount, Full-Color (RGB), 1204 Surface Mount LED (150° Viewing Angle); Manufacturer Part Number: OVSRRGBCC3; Pin Count: 4; Mounted: Yes; Socket: No; SMD: Yes; ComponentHeight: 1mm; HelpURL: \\cern.ch\dfs\Applications\Altium\Datasheets\LED_OPTEK_OVSRRGBCC3.pdf; Author: CERN DEM JLC; CreateDate: 2011-08-09; LatestRevisionDate: 2011-08-09
Q7 Q10 Q11 = Q_BSS138
R83 R178 R179 R277-R282 = RES_0402: SMD Resistor; Supplier 1: Newark; Supplier Part Number 1: 59M6691